# EAGLE design legatus_v0_2 (EAGLE 9.6.2)
CNAME: Parrot Teensy Board; CREVISION: 1.0; DESIGNER: Nathan Villicana-Shaw

## Sheet 1 of 2
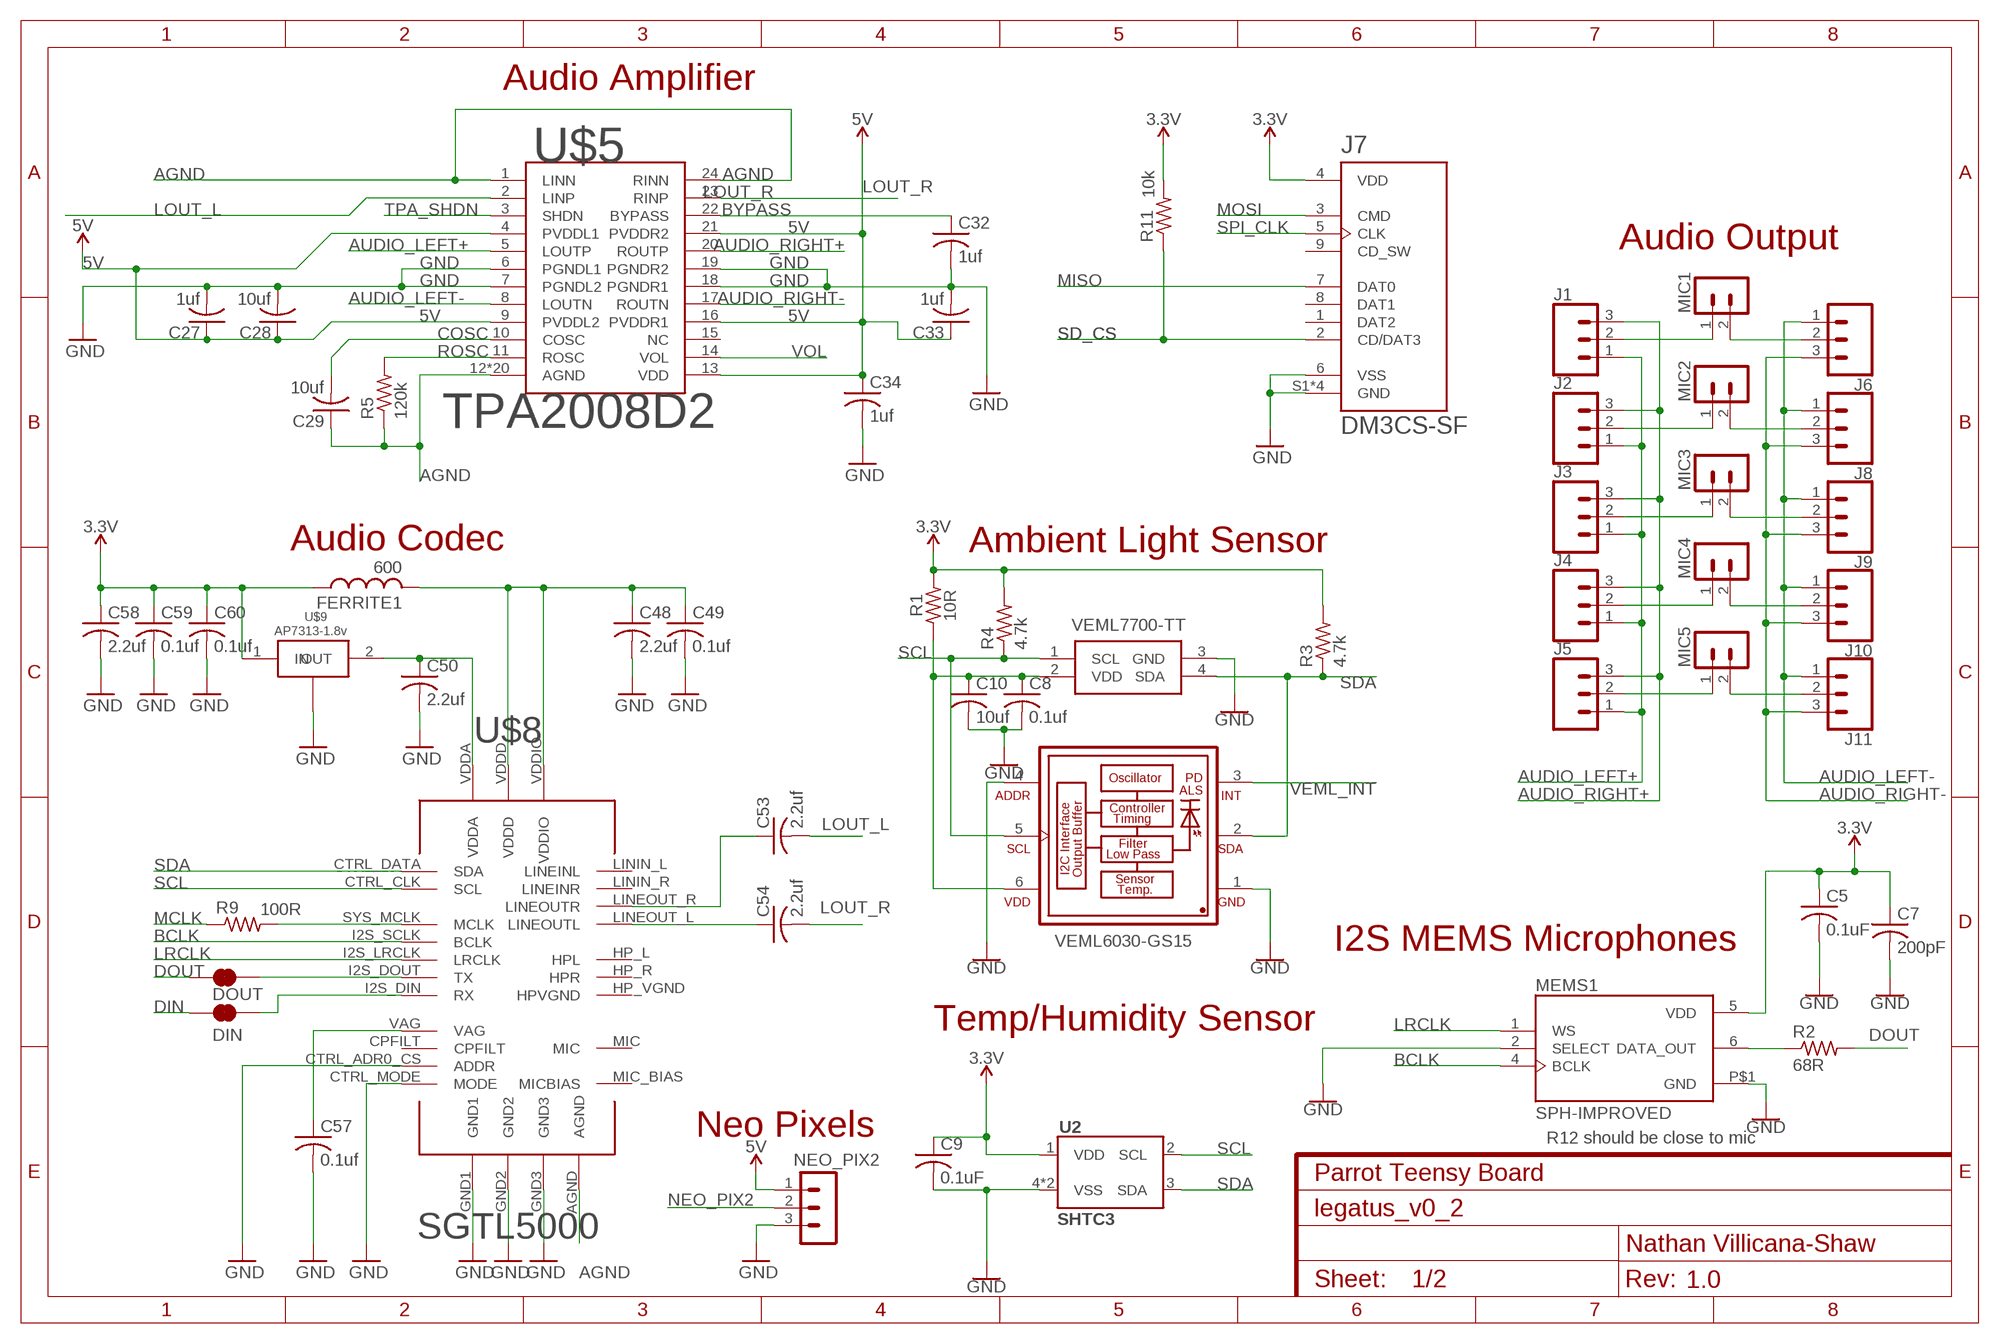
[diagram p0: schematic, sheet 1]

### Parts
C5  0.1uF  C-USC0805  [C0805]
C7  200pF  C-USC0805  [C0805]
C8  0.1uf  C-USC0805  [C0805]
C9  0.1uF  C-USC0805  [C0805]
C10  10uf  C-USC0805  [C0805]
C27  1uf  C-USC0805  [C0805]
C28  10uf  C-USC0805  [C0805]
C29  10uf  C-USC0805  [C0805]
C32  1uf  C-USC0805  [C0805]
C33  1uf  C-USC0805  [C0805]
C34  1uf  C-USC0805  [C0805]
C48  2.2uf  C-USC0805  [C0805]
C49  0.1uf  C-USC0805  [C0805]
C50  2.2uf  C-USC0805  [C0805]
C53  2.2uf  C-USC0805  [C0805]
C54  2.2uf  C-USC0805  [C0805]
C57  0.1uf  C-USC0805  [C0805]
C58  2.2uf  C-USC0805  [C0805]
C59  0.1uf  C-USC0805  [C0805]
C60  0.1uf  C-USC0805  [C0805]
DIN  JUMPER-SMT_2_NC_TRACE_SILK  [SMT-JUMPER_2_NC_TRACE_SILK]
DOUT  JUMPER-SMT_2_NC_TRACE_SILK  [SMT-JUMPER_2_NC_TRACE_SILK]
FERRITE1  600  INDUCTOR_0805_N  [RESC0805_N]
J1  CONN_03  [1X03]
J2  CONN_03  [1X03]
J3  CONN_03  [1X03]
J4  CONN_03  [1X03]
J5  CONN_03  [1X03]
J6  CONN_03  [1X03]
J7  DM3CS-SF  [HRS_DM3CS-SF]
J8  CONN_03  [1X03]
J9  CONN_03  [1X03]
J10  CONN_03  [1X03]
J11  CONN_03  [1X03]
MEMS1  SPH-IMPROVED  [MIC_SPH0645LM4H-B_LARGER_RING]
MIC1  B2B-PH-K  [B2B-PH-K]
MIC2  B2B-PH-K  [B2B-PH-K]
MIC3  B2B-PH-K  [B2B-PH-K]
MIC4  B2B-PH-K  [B2B-PH-K]
MIC5  B2B-PH-K  [B2B-PH-K]
NEO_PIX2  B3B-PH-K  [B3B-PH-K]
R1  10R  R-US_R0805  [R0805]
R2  68R  R-US_M0805  [M0805]
R3  4.7k  R-US_M0805  [M0805]
R4  4.7k  R-US_M0805  [M0805]
R5  120k  R-US_M0805  [M0805]
R9  100R  R-US_M0805  [M0805]
R11  10k  R-US_M0805  [M0805]
U2  SHTC3  [SHTC3]
U$5  TPA2008D2  [PWP-TSSOP24]
U$8  SGTL5000  [QFN-32-5X5MM]
U$9  AP7313-1.8v  AP7313  [SOT-23]
VEML1  VEML7700-TT  [VEML7700]
VMEL1  VEML6030-GS15  [VISHAY_VEML6030_2X2X0.87]

### Nets
3.3V [3.3V]: C5.1 C7.1 C9.1 C58.1 C59.1 C60.1 FERRITE1.1 J7.4(VDD) MEMS1.5(VDD) R1.2 R3.2 R4.2 R11.2 U2.1(VDD) U$9.1(IN) ; also sheet 2
5V: C27.1 C28.1 C33.1 C34.1 NEO_PIX2.1 U$5.4(PVDDL1) U$5.9(PVDDL2) U$5.13(VDD) U$5.16(PVDDR1) U$5.21(PVDDR2) ; also sheet 2
AGND: C29.1 R5.1 U$5.1(LINN) U$5.12(AGND) U$5.24(RINN) U$5.EXP(AGND) U$5.EXP@1(AGND) U$5.EXP@2(AGND) U$5.EXP@3(AGND) U$5.EXP@4(AGND) U$5.EXP@5(AGND) U$5.EXP@6(AGND) U$5.EXP@7(AGND) U$5.EXP@8(AGND) U$5.EXP@9(AGND) U$5.EXP@10(AGND) U$5.EXP@11(AGND) U$5.EXP@12(AGND) U$5.EXP@13(AGND) U$5.EXP@14(AGND) U$5.EXP@15(AGND) U$5.EXP@16(AGND) U$5.EXP@17(AGND) U$5.EXP@18(AGND) U$8.AGND ; also sheet 2
AUDIO_LEFT+: J1.1 J2.1 J3.1 J4.1 J5.1 U$5.5(LOUTP)
AUDIO_LEFT-: J6.1 J8.1 J9.1 J10.1 J11.1 U$5.8(LOUTN)
AUDIO_RIGHT+: J1.3 J2.3 J3.3 J4.3 J5.3 U$5.20(ROUTP)
AUDIO_RIGHT-: J6.3 J8.3 J9.3 J10.3 J11.3 U$5.17(ROUTN)
BCLK: MEMS1.4(BCLK) U$8.I2S_SCLK(BCLK) ; also sheet 2
BYPASS: C32.1 U$5.22(BYPASS)
COSC: C29.2 U$5.10(COSC)
DIN: DIN.1 ; also sheet 2
DOUT: DOUT.1 R2.2 ; also sheet 2
EDITROUTE: C48.1 C49.1 FERRITE1.2 U$8.VDDD U$8.VDDIO
GND: C5.2 C7.2 C8.2 C9.2 C10.2 C27.2 C28.2 C32.2 C33.2 C34.2 C48.2 C49.2 C50.2 C57.2 C58.2 C59.2 C60.2 J7.6(VSS) J7.S1(GND) J7.S2(GND) J7.S3(GND) J7.S5(GND) MEMS1.2(SELECT) MEMS1.P$1(GND) NEO_PIX2.3 U2.4(VSS) U2.5(VSS) U$5.6(PGNDL1) U$5.7(PGNDL2) U$5.18(PGNDR1) U$5.19(PGNDR2) U$8.CTRL_ADR0_CS(ADDR) U$8.CTRL_MODE(MODE) U$8.GND1 U$8.GND2 U$8.GND3 U$9.3(GND) VEML1.3(GND) VMEL1.1(GND) VMEL1.4(ADDR) ; also sheet 2
LOUT_L: C53.2 U$5.2(LINP)
LOUT_R: C54.2 U$5.23(RINP)
LRCLK: MEMS1.1(WS) U$8.I2S_LRCLK(LRCLK) ; also sheet 2
MCLK: R9.1 ; also sheet 2
MISO: J7.7(DAT0) ; also sheet 2
MOSI: J7.3(CMD) ; also sheet 2
N$1: MEMS1.6(DATA_OUT) R2.1
N$2: J1.2 MIC1.1
N$3: J2.2 MIC2.1
N$4: C8.1 C10.1 R1.1 VEML1.2(VDD) VMEL1.6(VDD)
N$6: J3.2 MIC3.1
N$7: J4.2 MIC4.1
N$8: J5.2 MIC5.1
N$25: J6.2 MIC1.2
N$27: C53.1 U$8.LINEOUT_R(LINEOUTR)
N$28: C54.1 U$8.LINEOUT_L(LINEOUTL)
N$32: J8.2 MIC2.2
N$34: C57.1 U$8.VAG
N$35: DIN.2 U$8.I2S_DIN(RX)
N$36: DOUT.2 U$8.I2S_DOUT(TX)
N$38: R9.2 U$8.SYS_MCLK(MCLK)
N$39: C50.1 U$8.VDDA U$9.2(OUT)
N$40: J9.2 MIC3.2
N$42: J10.2 MIC4.2
N$44: J11.2 MIC5.2
NEO_PIX2: NEO_PIX2.2 ; also sheet 2
ROSC: R5.2 U$5.11(ROSC)
SCL: R4.1 U2.2(SCL) U$8.CTRL_CLK(SCL) VEML1.1(SCL) VMEL1.5(SCL) ; also sheet 2
SD_CS: J7.2(CD/DAT3) R11.1 ; also sheet 2
SDA: R3.1 U2.3(SDA) U$8.CTRL_DATA(SDA) VEML1.4(SDA) VMEL1.2(SDA) ; also sheet 2
SPI_CLK: J7.5(CLK) ; also sheet 2
TPA_SHDN: U$5.3(SHDN) ; also sheet 2
VEML_INT: VMEL1.3(INT) ; also sheet 2
VOL: U$5.14(VOL) ; also sheet 2
Unconnected: J7.1(DAT2) J7.8(DAT1) J7.9(CD_SW) U$5.15(NC) U$8.CPFILT U$8.HP_L(HPL) U$8.HP_R(HPR) U$8.HP_VGND(HPVGND) U$8.LININ_L(LINEINL) U$8.LININ_R(LINEINR) U$8.MIC U$8.MIC_BIAS(MICBIAS)

### Notes on the sheet
- Audio Amplifier
- Audio Output
- Audio Codec | Ambient Light Sensor
- 10R
- I2S MEMS Microphones
- Temp/Humidity Sensor
- Neo Pixels
- R12 should be close to mic

## Sheet 2 of 2
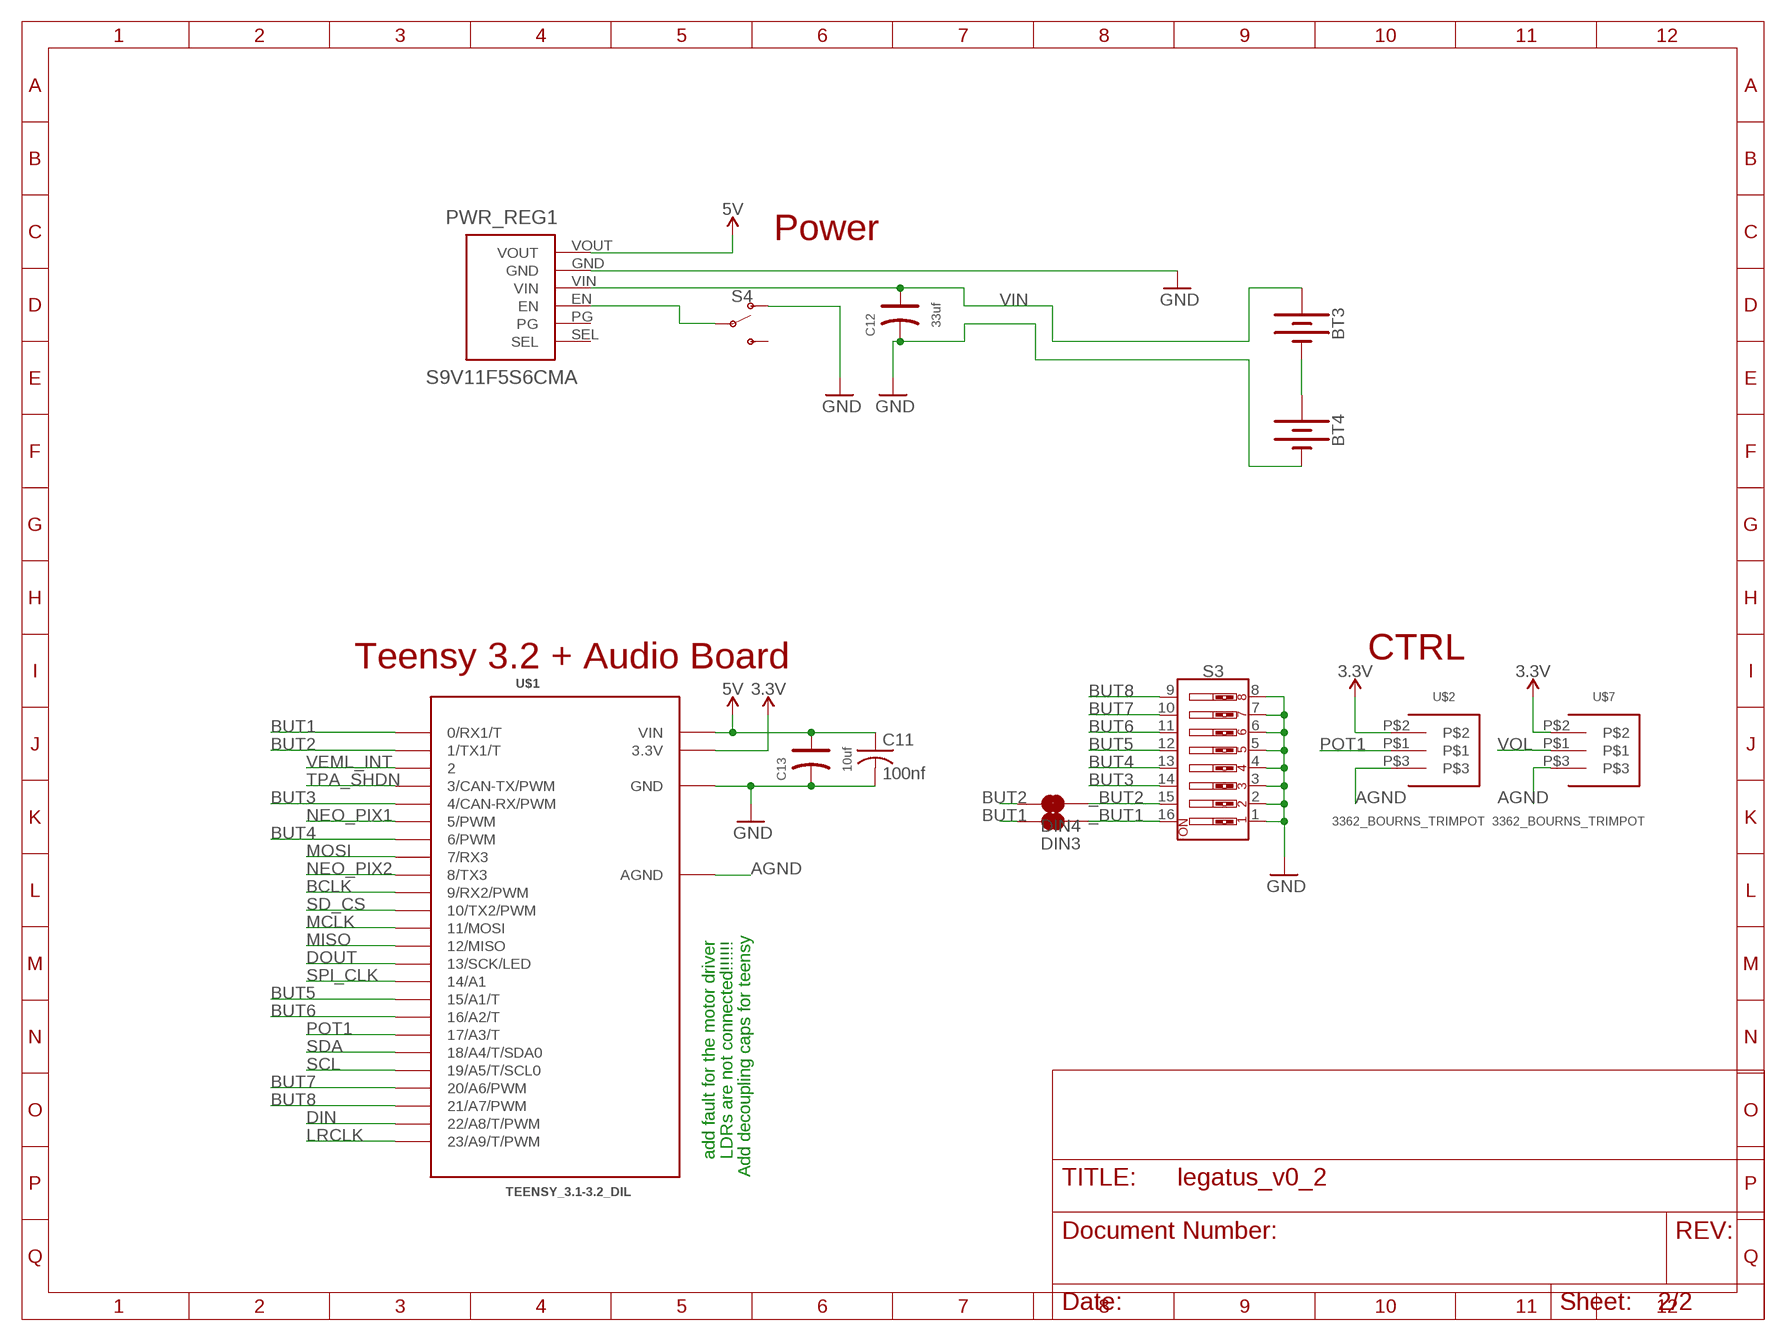
[diagram p1: schematic, sheet 2, part 1 of 2]
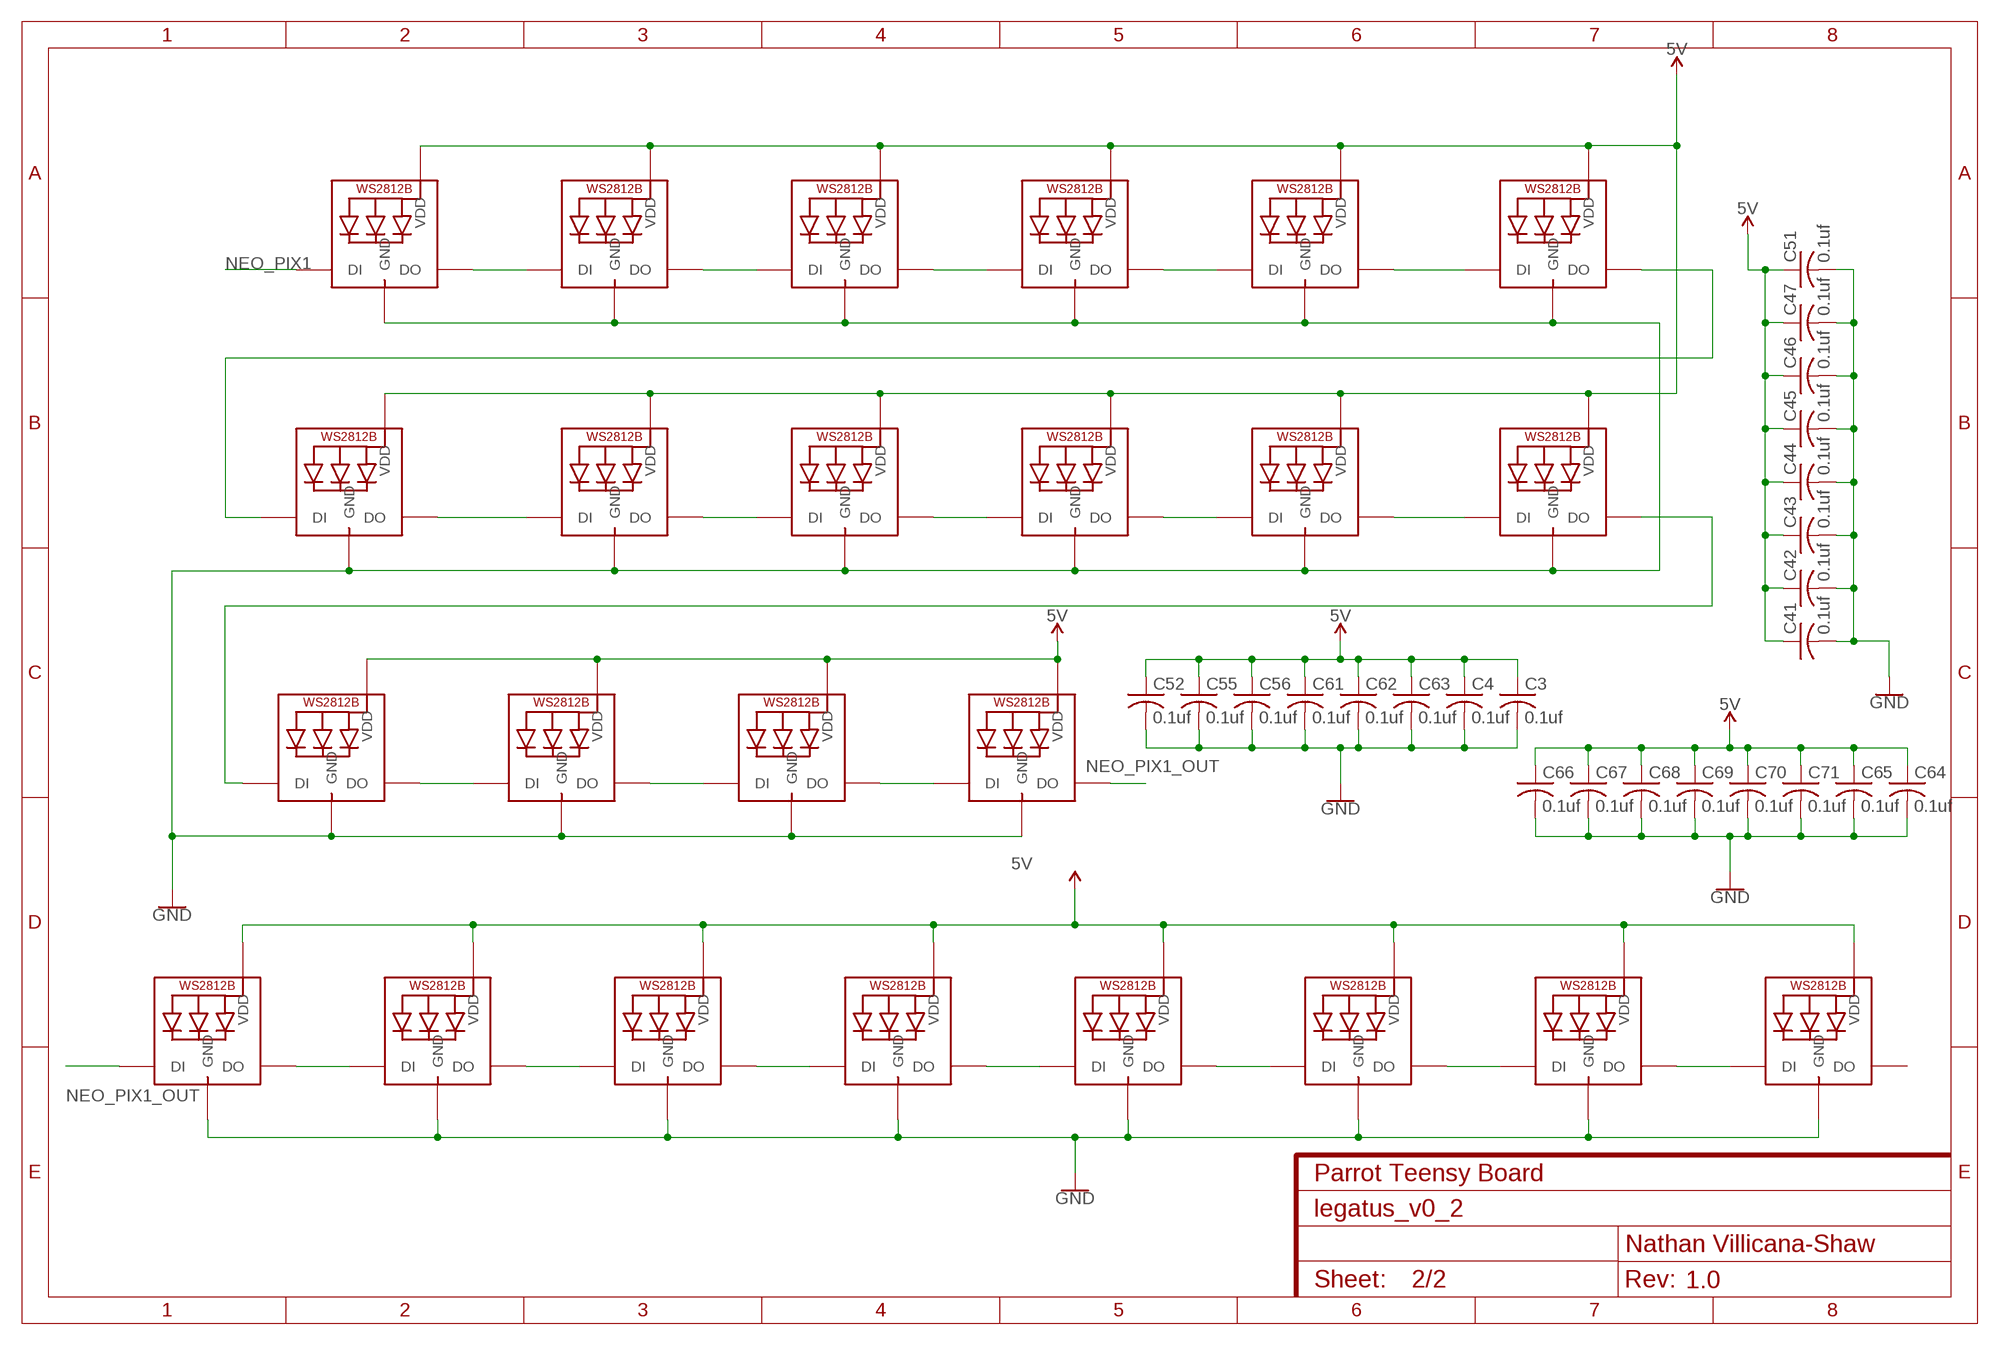
[diagram p2: schematic, sheet 2, part 2 of 2]

### Parts
BT3  BATTERY-18650  [BATTERY_18650-HOLDER]
BT4  BATTERY-18650  [BATTERY_18650-HOLDER]
C3  0.1uf  C-USC0805  [C0805]
C4  0.1uf  C-USC0805  [C0805]
C11  100nf  C-USC2012  [C2012]
C12  33uf  DIP-ALUMINUM-47UF-16V(D5-H7MM)  [PC-D5.3MM]
C13  10uf  DIP-ALUMINUM-47UF-16V(D5-H7MM)  [PC-D5.3MM]
C41  0.1uf  C-USC0805  [C0805]
C42  0.1uf  C-USC0805  [C0805]
C43  0.1uf  C-USC0805  [C0805]
C44  0.1uf  C-USC0805  [C0805]
C45  0.1uf  C-USC0805  [C0805]
C46  0.1uf  C-USC0805  [C0805]
C47  0.1uf  C-USC0805  [C0805]
C51  0.1uf  C-USC0805  [C0805]
C52  0.1uf  C-USC0805  [C0805]
C55  0.1uf  C-USC0805  [C0805]
C56  0.1uf  C-USC0805  [C0805]
C61  0.1uf  C-USC0805  [C0805]
C62  0.1uf  C-USC0805  [C0805]
C63  0.1uf  C-USC0805  [C0805]
C64  0.1uf  C-USC0805  [C0805]
C65  0.1uf  C-USC0805  [C0805]
C66  0.1uf  C-USC0805  [C0805]
C67  0.1uf  C-USC0805  [C0805]
C68  0.1uf  C-USC0805  [C0805]
C69  0.1uf  C-USC0805  [C0805]
C70  0.1uf  C-USC0805  [C0805]
C71  0.1uf  C-USC0805  [C0805]
DIN3  JUMPER-SMT_2_NC_TRACE_SILK  [SMT-JUMPER_2_NC_TRACE_SILK]
DIN4  JUMPER-SMT_2_NC_TRACE_SILK  [SMT-JUMPER_2_NC_TRACE_SILK]
LED25  WS2812B_5050N  [WS2812B-NARROW]
LED26  WS2812B_5050N  [WS2812B-NARROW]
LED27  WS2812B_5050N  [WS2812B-NARROW]
LED28  WS2812B_5050N  [WS2812B-NARROW]
LED29  WS2812B_5050N  [WS2812B-NARROW]
LED30  WS2812B_5050N  [WS2812B-NARROW]
LED31  WS2812B_5050N  [WS2812B-NARROW]
LED32  WS2812B_5050N  [WS2812B-NARROW]
LED33  WS2812B_5050N  [WS2812B-NARROW]
LED34  WS2812B_5050N  [WS2812B-NARROW]
LED35  WS2812B_5050N  [WS2812B-NARROW]
LED36  WS2812B_5050N  [WS2812B-NARROW]
LED37  WS2812B_5050N  [WS2812B-NARROW]
LED38  WS2812B_5050N  [WS2812B-NARROW]
LED39  WS2812B_5050N  [WS2812B-NARROW]
LED40  WS2812B_5050N  [WS2812B-NARROW]
LED41  WS2812B_5050N  [WS2812B-NARROW]
LED42  WS2812B_5050N  [WS2812B-NARROW]
LED43  WS2812B_5050N  [WS2812B-NARROW]
LED44  WS2812B_5050N  [WS2812B-NARROW]
LED45  WS2812B_5050N  [WS2812B-NARROW]
LED46  WS2812B_5050N  [WS2812B-NARROW]
LED47  WS2812B_5050N  [WS2812B-NARROW]
LED48  WS2812B_5050N  [WS2812B-NARROW]
PWR_REG1  S9V11F5S6CMA  [S9V11F3S5CMA]
S3  DIP-08-PTH  [DIPSWITCH-08]
S4  SWITCH-SPDT-PTH-11.6X4.0MM-LOCK  [SWITCH_SPDT_PTH_11.6X4.0MM_LOCK]
U$1  TEENSY_3.1-3.2_DIL  [TEENSY_3.0-3.2&LC_DIL]
U$2  3362_BOURNS_TRIMPOT  [3362_BOURNS_TRIMPOT]
U$7  3362_BOURNS_TRIMPOT  [3362_BOURNS_TRIMPOT]

### Nets
3.3V [3.3V]: U$1.3.3V U$2.P$2 U$7.P$2 ; also sheet 1
5V: C3.1 C4.1 C11.1 C13.+ C41.1 C42.1 C43.1 C44.1 C45.1 C46.1 C47.1 C51.1 C52.1 C55.1 C56.1 C61.1 C62.1 C63.1 C64.1 C65.1 C66.1 C67.1 C68.1 C69.1 C70.1 C71.1 LED25.1-VDD(VDD) LED26.1-VDD(VDD) LED27.1-VDD(VDD) LED28.1-VDD(VDD) LED29.1-VDD(VDD) LED30.1-VDD(VDD) LED31.1-VDD(VDD) LED32.1-VDD(VDD) LED33.1-VDD(VDD) LED34.1-VDD(VDD) LED35.1-VDD(VDD) LED36.1-VDD(VDD) LED37.1-VDD(VDD) LED38.1-VDD(VDD) LED39.1-VDD(VDD) LED40.1-VDD(VDD) LED41.1-VDD(VDD) LED42.1-VDD(VDD) LED43.1-VDD(VDD) LED44.1-VDD(VDD) LED45.1-VDD(VDD) LED46.1-VDD(VDD) LED47.1-VDD(VDD) LED48.1-VDD(VDD) PWR_REG1.VOUT U$1.VIN ; also sheet 1
_BUT1: DIN3.2 S3.16
_BUT2: DIN4.2 S3.15
AGND: U$1.AGND U$2.P$3 U$7.P$3 ; also sheet 1
BCLK: U$1.9(9/RX2/PWM) ; also sheet 1
BUT1: DIN3.1 U$1.0(0/RX1/T)
BUT2: DIN4.1 U$1.1(1/TX1/T)
BUT3: S3.14 U$1.4(4/CAN-RX/PWM)
BUT4: S3.13 U$1.6(6/PWM)
BUT5: S3.12 U$1.15/A1(15/A1/T)
BUT6: S3.11 U$1.16/A2(16/A2/T)
BUT7: S3.10 U$1.20/A6(20/A6/PWM)
BUT8: S3.9 U$1.21/A7(21/A7/PWM)
DIN: U$1.22/A8(22/A8/T/PWM) ; also sheet 1
DOUT: U$1.13(13/SCK/LED) ; also sheet 1
GND: BT4.GND@1(-) C3.2 C4.2 C11.2 C12.- C13.- C41.2 C42.2 C43.2 C44.2 C45.2 C46.2 C47.2 C51.2 C52.2 C55.2 C56.2 C61.2 C62.2 C63.2 C64.2 C65.2 C66.2 C67.2 C68.2 C69.2 C70.2 C71.2 LED25.3-GND(GND) LED26.3-GND(GND) LED27.3-GND(GND) LED28.3-GND(GND) LED29.3-GND(GND) LED30.3-GND(GND) LED31.3-GND(GND) LED32.3-GND(GND) LED33.3-GND(GND) LED34.3-GND(GND) LED35.3-GND(GND) LED36.3-GND(GND) LED37.3-GND(GND) LED38.3-GND(GND) LED39.3-GND(GND) LED40.3-GND(GND) LED41.3-GND(GND) LED42.3-GND(GND) LED43.3-GND(GND) LED44.3-GND(GND) LED45.3-GND(GND) LED46.3-GND(GND) LED47.3-GND(GND) LED48.3-GND(GND) PWR_REG1.GND S3.1 S3.2 S3.3 S3.4 S3.5 S3.6 S3.7 S3.8 S4.1(O) U$1.GND ; also sheet 1
LRCLK: U$1.23/A9(23/A9/T/PWM) ; also sheet 1
MCLK: U$1.11(11/MOSI) ; also sheet 1
MISO: U$1.12(12/MISO) ; also sheet 1
MOSI: U$1.7(7/RX3) ; also sheet 1
N$9: PWR_REG1.EN S4.2(P)
N$10: BT3.GND@1(-) BT4.PWR@1(+)
N$41: LED25.2-DOUT(DO) LED26.4-DIN(DI)
N$45: LED26.2-DOUT(DO) LED27.4-DIN(DI)
N$46: LED27.2-DOUT(DO) LED28.4-DIN(DI)
N$47: LED28.2-DOUT(DO) LED29.4-DIN(DI)
N$48: LED29.2-DOUT(DO) LED30.4-DIN(DI)
N$49: LED31.2-DOUT(DO) LED32.4-DIN(DI)
N$50: LED32.2-DOUT(DO) LED33.4-DIN(DI)
N$51: LED33.2-DOUT(DO) LED34.4-DIN(DI)
N$52: LED34.2-DOUT(DO) LED35.4-DIN(DI)
N$53: LED35.2-DOUT(DO) LED36.4-DIN(DI)
N$54: LED37.2-DOUT(DO) LED38.4-DIN(DI)
N$55: LED38.2-DOUT(DO) LED39.4-DIN(DI)
N$56: LED39.2-DOUT(DO) LED40.4-DIN(DI)
N$57: LED36.2-DOUT(DO) LED37.4-DIN(DI)
N$58: LED30.2-DOUT(DO) LED31.4-DIN(DI)
N$59: LED42.2-DOUT(DO) LED43.4-DIN(DI)
N$60: LED43.2-DOUT(DO) LED44.4-DIN(DI)
N$61: LED44.2-DOUT(DO) LED45.4-DIN(DI)
N$62: LED45.2-DOUT(DO) LED46.4-DIN(DI)
N$63: LED46.2-DOUT(DO) LED47.4-DIN(DI)
N$64: LED47.2-DOUT(DO) LED48.4-DIN(DI)
N$65: LED41.2-DOUT(DO) LED42.4-DIN(DI)
NEO_PIX1: LED25.4-DIN(DI) U$1.5(5/PWM)
NEO_PIX1_OUT: LED40.2-DOUT(DO) LED41.4-DIN(DI)
NEO_PIX2: U$1.8(8/TX3) ; also sheet 1
POT1: U$1.17/A3(17/A3/T) U$2.P$1
SCL: U$1.19/A5(19/A5/T/SCL0) ; also sheet 1
SD_CS: U$1.10(10/TX2/PWM) ; also sheet 1
SDA: U$1.18/A4(18/A4/T/SDA0) ; also sheet 1
SPI_CLK: U$1.14/A0(14/A1) ; also sheet 1
TPA_SHDN: U$1.3(3/CAN-TX/PWM) ; also sheet 1
VEML_INT: U$1.2 ; also sheet 1
VIN [12V_IN]: BT3.PWR@1(+) C12.+ PWR_REG1.VIN
VOL: U$7.P$1 ; also sheet 1
Unconnected: LED48.2-DOUT(DO) PWR_REG1.PG PWR_REG1.SEL S4.3(S)

### Notes on the sheet
- Power
- Teensy 3.2 + Audio Board | CTRL
- add fault for the motor driver | LDRs are not connected!!!!!!
- Add decoupling caps for teensy

## Library data of the parts
BT3 BT4 = SparkFun-Batteries:BATTERY: Battery - Single Cell A variety of battery chemistries, sizes, and footprints. Device List: 20MM_PTH - Coin Cell Battery Holder - 20mm (PTH) <https://www.sparkfun.com/products/783> 6.8MM_PTH - Coin Cell Battery Holder - 6.8MM(SMD) <https://www.digikey.com/product-detail/en/seiko-instruments/MS621FE-FL11E/728-1057-ND/1889208?WT.srch=1&gclid=CNOQ5a6LzdQCFZS2wAodXCkE0g> 12MM_SMD - Coin Cell Battery Holder - 12mm (SMD) <https://www.sparkfun.com/products/10592> 12MM_PTH - Coin Cell Battery Holder - 12mm (PTH) <https://www.sparkfun.com/products/7948> 20MM_SMD - 20mm Coin Cell Battery Holder (SMD) (2 legs) Used on the Big Time Watch Kit <https://www.sparkfun.com/products/11734> 20MM_SMD_4LEGS - Coin Cell Battery Holder - 20mm (SMD) <https://www.sparkfun.com/products/11892> 20MM_SMD_4LEGS_OVERPASTE - Coin Cell Battery Holder - 20mm (SMD) <https://www.sparkfun.com/products/11892> (Over-paste on the legs) 24.5MM_PTH - Coin Cell Battery Holder - 24.5mm (PTH) <https://www.sparkfun.com/products/8863> 9V - 9V Battery Holder - PC Mount Used on the SparkFun SparkPunk Sound Kit <https://www.sparkfun.com/products/11177> and SparkFun SparkPunk Sequencer Kit <https://www.sparkfun.com/products/12707> 18650 - Battery Holder - 18650 (PTH) <https://www.sparkfun.com/products/13113> AA - Battery Holder - 1xAA (PTH) <https://www.sparkfun.com/products/7949> AAA - Battery Holder - 1xAAA (PTH) <https://www.sparkfun.com/products/12718> AA_KIT - Battery Holder - 1xAA (PTH) <https://www.sparkfun.com/products/7949> Special kit package - pads only have exposed copper on one side of the board. AAA_KIT - Battery Holder - 1xAAA (PTH) <https://www.sparkfun.com/products/12718> Special kit package - pads only have exposed copper on one side of the board.; PROD_ID: BATT-12327; SF_SKU: PRT-13113
C3-C5 C7-C10 C27-C29 C32-C34 C41-C71 = rcl:C-US: CAPACITOR, American symbol; SPICEPREFIX: C
C11 = adafruit:C-US: CAPACITOR, American symbol
C12 C13 = Seeed-Capacitor:DIP-ALUMINUM-47UF-16V(D5-H7MM): 302030033; MPN: KS 100uF/16V; VALUE: 100uf
DIN DIN3 DIN4 DOUT = SparkFun-Jumpers:JUMPER-SMT_2_NC_TRACE: Normally closed trace jumper This jumper has a trace between two pads so it's normally closed (NC). Use a razor knife to open the connection. For best results follow the IPC guidelines for cutting traces: Cutout at least 0.063 mm (0.005 in). Remove all loose material to clean up the cut area. Seal the cut with an approved epoxy. Reapply solder to reclose the connection.
FERRITE1 = Nordic_nRF:INDUCTOR: Generic chip inductor
J1-J6 J8-J11 = SparkFun-Connectors:CONN_03: Multi connection point. Often used as Generic Header-pin footprint for 0.1 inch spaced/style header connections On any of the 0.1 inch spaced packages, you can populate with these: Break Away Headers - Straight <https://www.sparkfun.com/products/116> (PRT-00116) Break Away Male Headers - Right Angle <https://www.sparkfun.com/products/553> (PRT-00553) Female Headers <https://www.sparkfun.com/products/115> (PRT-00115) Break Away Headers - Machine Pin <https://www.sparkfun.com/products/117> (PRT-00117) Break Away Female Headers - Swiss Machine Pin <https://www.sparkfun.com/products/743> (PRT-00743) Stackable Header - 3 Pin (Female, 0.1") <https://www.sparkfun.com/products/13875> (PRT-13875) For SCREWTERMINALS and SPRING TERMINALS visit here: Screw Terimnals on SparkFun.com <https://www.sparkfun.com/search/results?term=Screw+Terminals> (5mm/3.5mm/2.54mm spacing) This device is also useful as a general connection point to wire up your design to another part of your project. Our various solder wires solder well into these plated through hole pads. Hook-Up Wire - Assortment (Stranded, 22 AWG) <https://www.sparkfun.com/products/11375> (PRT-11375) Hook-Up Wire - Assortment (Solid Core, 22 AWG) <https://www.sparkfun.com/products/11367> (PRT-11367) View the entire wire category on our website here <https://www.sparkfun.com/categories/141> Special notes: Molex polarized connector foot print use with SKU : PRT-08232 with associated crimp pins and housings.
J7 = DM3CS-SF:DM3CS-SF: CONN MICRO SD CARD HINGED TYPE; AVAILABILITY: Unavailable; DESCRIPTION: 10 (8 + 2) Position Card Connector Secure Digital - microSD™ Surface Mount, Right Angle Gold; MF: Hirose; MP: DM3CS-SF; PACKAGE: None; PRICE: None
LED25-LED48 = nathans-custom-parts:WS2812B
MEMS1 = SPH0645LM4H-B:SPH-IMPROVED
MIC1-MIC5 = con-jst-ph:B2B-PH-K: HEADER
NEO_PIX2 = con-jst-ph:B3B-PH-K: HEADER
PWR_REG1 = nathans-custom-parts:S9V11F5S6CMA
R1 = audio amplifier example:R-US_: RESISTOR, American symbol
R2-R5 = adafruit:R-US_: RESISTOR, American symbol
R9 R11 = rcl:R-US_: RESISTOR, American symbol; SPICEPREFIX: R
S3 = SparkFun-Switches:DIP-08: 8-Position DIP Switch 8-circuit DIP (dual inline package) switch. Commonly used to physcially set a circuit's behavior. SparkFun Products DIP Switch - 8 Position <https://www.sparkfun.com/products/8034> (COM-08034); PROD_ID: SWCH-12197; SF_SKU: COM-08034
S4 = SparkFun-Switches:SWITCH-SPDT: Single Pole, Double Throw (SPDT) Switch Single-pole, double-throw (SPDT) switch. Variant Overview SMD-AYZ0202 Surface Mount DPDT Switch <https://www.sparkfun.com/products/597> (COM-00597) Used on e.g. LilyPad Arduino USB - ATmega32U4 Board <https://www.sparkfun.com/products/12049> PTH-11.6X4.0MM SPDT Mini Power Switch <https://www.sparkfun.com/products/102> (COM-00102) Used on e.g. SparkFun Simon Says - Through-Hole Soldering Kit <https://www.sparkfun.com/products/10547> (KIT-10547) PTH-11.6X4.0MM-KIT KIT version of SPDT Mini Power Switch - Simplifies soldering by removing tStop of switch pins - only one side can be soldered. PTH-11.6X4.0MM-LOCK LOCK version of SPDT Mini Power Switch - Offset pins hold switch in place for easier soldering. SMD-RIGHT-ANGLE Surface Mount Right Angle Switch <https://www.sparkfun.com/products/10860> (COM-10860) Used on e.g. SparkFun ESP8266 Thing <https://www.sparkfun.com/products/13231>; PROD_ID: SWCH-08261; SF_SKU: COM-00102
U2 = SHTC3:SHTC3
U$1 = teensy_3_and_LC:TEENSY_3.1-3.2_DIL: Teensy 3.1 or 3.2 in a DIL Layout.
U$2 U$7 = nathans-custom-parts:3362_BOURNS_TRIMPOT
U$5 = TPA2008D3:TPA2008D2
U$8 = sgtl5000:SGTL5000
U$9 = AP7313:AP7313
VEML1 = VEML7700-TT:VEML7700-TT: 16Bit Ambient Light Sensor I2C 6.8x2.3mm Source: Datasheet <https://www.arrow.com/en/products/veml7700-tt/vishay>; DESCRIPTION: 16Bit Ambient Light Sensor I2C 6.8x2.3mm; HEIGHT: mm; MANUFACTURER_NAME: Vishay; MANUFACTURER_PART_NUMBER: VEML7700-TT; MOUSER_PART_NUMBER: 78-VEML7700-TT; MOUSER_PRICE-STOCK: https://www.mouser.com/Search/Refine.aspx?Keyword=78-VEML7700-TT; RS_PART_NUMBER: 1226791P; RS_PRICE-STOCK: http://uk.rs-online.com/web/p/products/1226791P
VMEL1 = VEML6030-GS15:VEML6030-GS15: VEML6030 High Accuracy Ambient Light Sensor with I2C Interface: VEML6030 is a high accuracy ambient light digital 16-bit resolution sensor in a miniature transparent 2 mm x 2 mm package. It includes a high sensitive photodiode, a low noise amplifier, a 16-bit A/D converter and supports an easy to use I2C bus communication interface and additional interrupt feature. The ambient light result is as digital value available. Device Model created 15.06.2016 by Johannes Kolb - Vishay Semiconductor GmbH; AVAILABILITY: Unavailable; DESCRIPTION: Optical Sensor Ambient 550nm I²C 6-SMD, No Lead; MF: Vishay Semiconductor; MP: VEML6030-GS15; PACKAGE: SMD-6 Vishay; PRICE: None

## Net classes
0 default: width 0.203 mm, drill 0.254 mm, clearance 0.203 mm
1 12V_IN: width 1.016 mm, drill 0.762 mm, clearance 0.305 mm
2 3.3V: width 0.305 mm, drill 0.508 mm, clearance 0.254 mm
3 5V: width 0.787 mm, drill 0.508 mm, clearance 0.381 mm

## Board
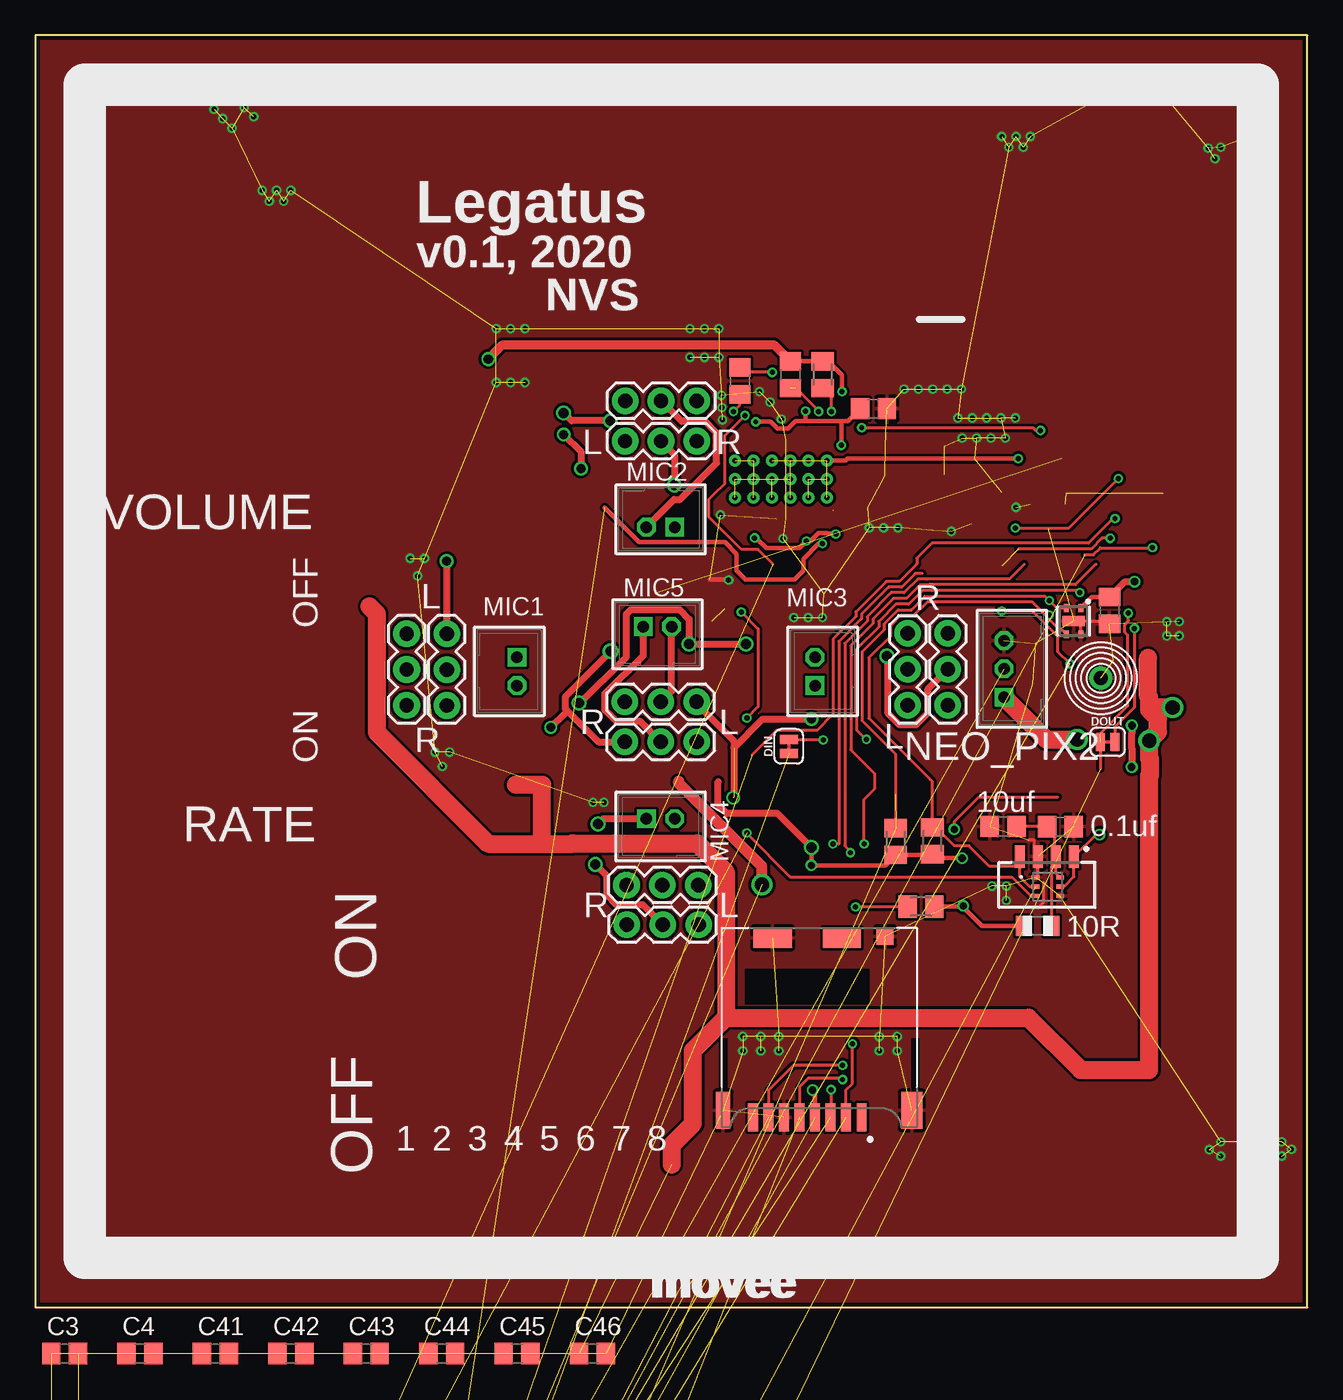
[diagram p3: board, top side]
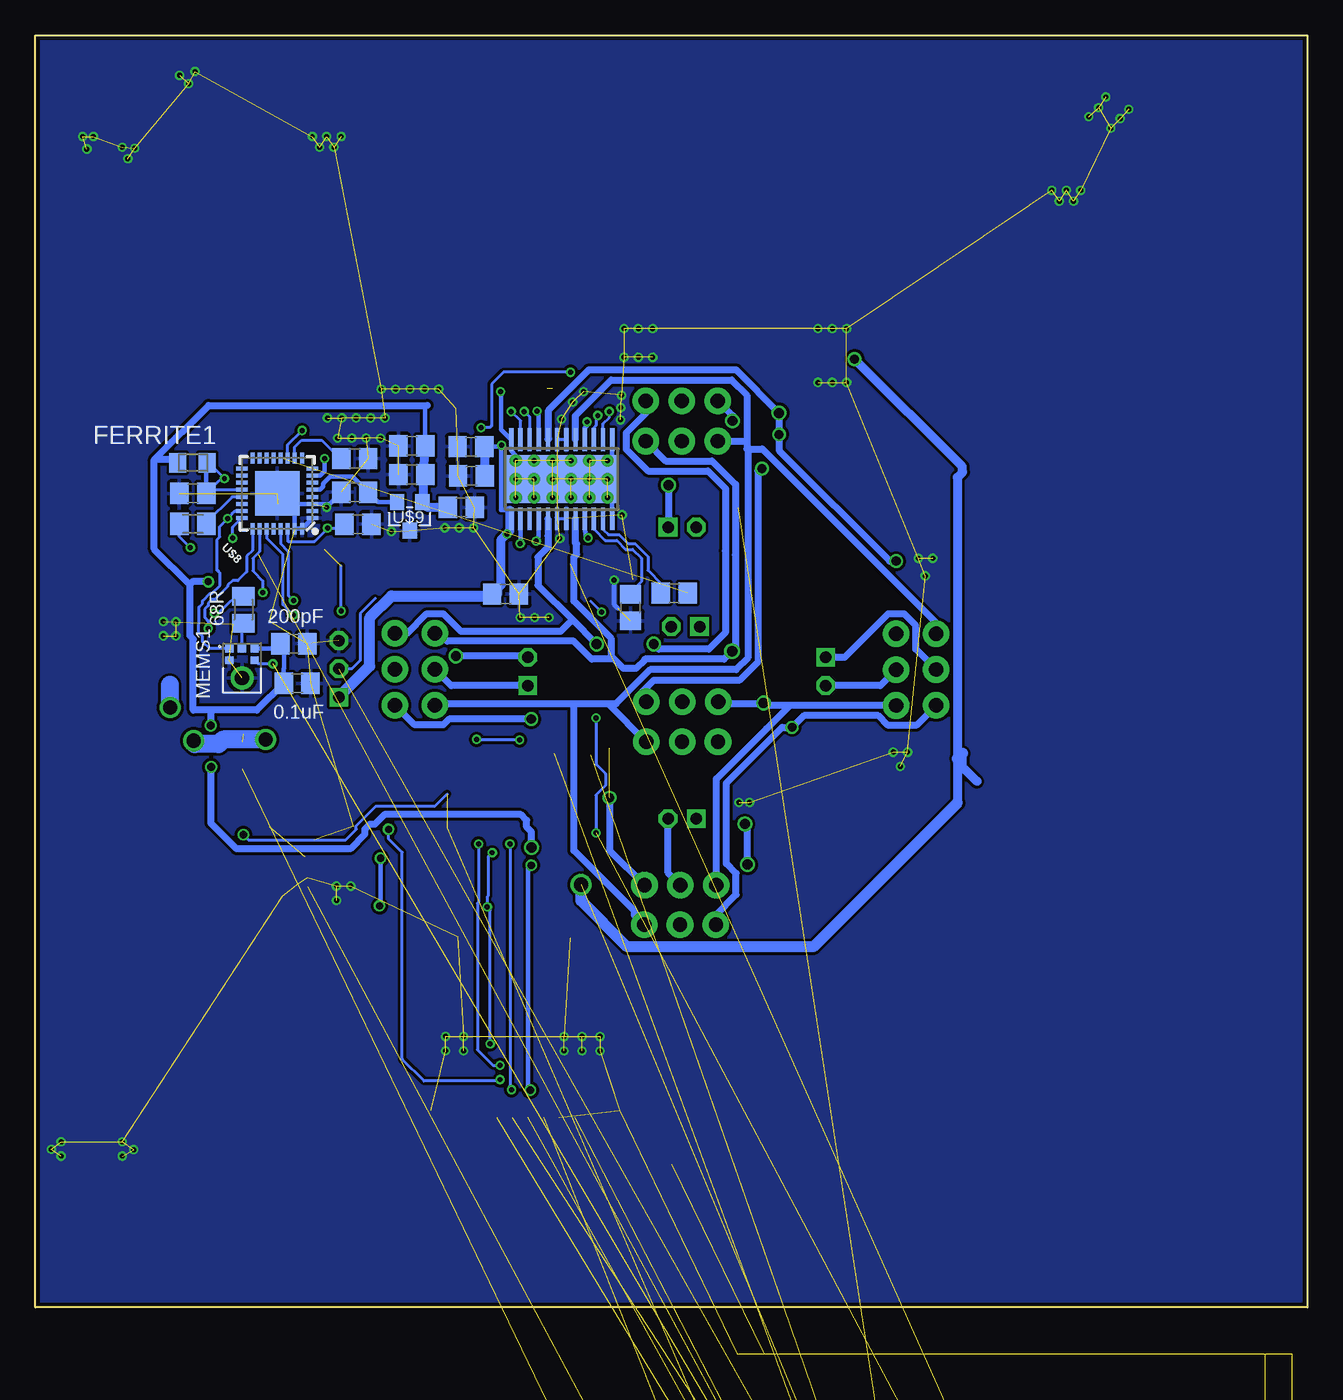
[diagram p4: board, bottom side, seen from below]

Size 90 x 90 mm. Coordinates in mm from the lower left corner, seen from the top.
Outline: 0,90 0,0 90,0 90,90 0,90
Copper layers (1*16): Top 0.035mm / dielectric 1.5mm / Bottom 0.035mm
Design rules "SeeedStudio_2layer_DRU_no_angle_20140221": minimum track width 6mil, minimum drill 12mil, track to track 6mil, track to pad 6mil, pad to pad 6mil, via to via 6mil, smd to smd 0mil, copper to edge 10mil, drill to drill 10mil, minimum pad ring 10mil, minimum via ring 6mil, stop-mask expansion 2mil, vias tented up to drill 100mil, thermal gap 10mil

### Footprints (pad centres in the part's own frame; a part is rotated, then mirrored left to right if it is on the bottom)
BATTERY_18650-HOLDER = drill 1.829: GND@1 30.628,0.01; GND@2 23.88,2.55; GND@3 23.88,-2.53; PWR@1 -30.628,-0.01; PWR@2 -23.88,2.53; PWR@3 -23.88,-2.55
C0805 = smd 1.3 x 1.5: 1 -0.95,0; 2 0.95,0
C2012 = smd 1.3 x 1.5: 1 -0.85,0; 2 0.85,0
PC-D5.3MM = drill 0.8 pad 1.35 square: + -1,0 | drill 0.8 pad 1.35: - 1,0
SMT-JUMPER_2_NC_TRACE_SILK = smd 0.635 x 1.27: 1 -0.508,0; 2 0.508,0
RESC0805_N = smd 1.2 x 1.35: 1 -1.1,0; 2 1,0
1X03 = drill 1.016 pad 1.88: 1 0,0; 2 2.54,0; 3 5.08,0
HRS_DM3CS-SF = smd 0.7 x 2: 1 3.2,-6.35; 2 2.1,-6.35; 3 1,-6.35; 4 -0.1,-6.35; 5 -1.2,-6.35; 6 -2.3,-6.35; 7 -3.4,-6.35; 8 -4.5,-6.35 | smd 2.7 x 1.4: 9 1.8,6.35; S3 -3.1,6.35 | smd 1 x 2.6: S1 -6.6,-5.85 | smd 1.5 x 2.6: S2 6.75,-5.85 | smd 1.2 x 1.2: S5 4.85,6.45
WS2812B-NARROW = smd 1.3 x 1.2: 1-VDD 2.35,-1.65; 2-DOUT 2.35,1.65; 3-GND -2.35,1.65; 4-DIN -2.35,-1.65
MIC_SPH0645LM4H-B_LARGER_RING = smd 0.6 x 0.522: 1 -0.9,2.074; 2 -0.9,1.252; 4 0.9,1.252; 5 0.9,2.074; 6 0,2.074 | drill 1 pad 1.626: P$1 0,0
B2B-PH-K = drill 0.813 square: 1 -1,0 | drill 0.813 octagon: 2 1,0
B3B-PH-K = drill 0.813 square: 1 -2,0 | drill 0.813 octagon: 2 0,0; 3 2,0
S9V11F3S5CMA = drill 0.85: EN 3.81,1.27; PG 1.27,1.27; SEL 1.27,3.81; VIN 6.35,1.27; VOUT 11.43,1.27 | drill 0.85 square: GND 8.89,1.27
R0805 = smd 1.1 x 1.4: 1 -1,0; 2 1,0
M0805 = smd 1.3 x 1.6: 1 -0.95,0; 2 0.95,0
DIPSWITCH-08 = drill 0.97 long: 1 -8.89,-3.81; 2 -6.35,-3.81; 3 -3.81,-3.81; 4 -1.27,-3.81; 5 1.27,-3.81; 6 3.81,-3.81; 7 6.35,-3.81; 8 8.89,-3.81; 9 8.89,3.81; 10 6.35,3.81; 11 3.81,3.81; 12 1.27,3.81; 13 -1.27,3.81; 14 -3.81,3.81; 15 -6.35,3.81; 16 -8.89,3.81
SWITCH_SPDT_PTH_11.6X4.0MM_LOCK = drill 1.016 pad 1.88: 1 0,2.718; 2 0,0; 3 0,-2.718
SHTC3 = smd 0.55 x 0.35: 1 -0.925,0.5; 2 -0.925,-0.5; 3 0.925,-0.5; 4 0.925,0.5 | smd 0.7 x 1.6: 5 0,0
TEENSY_3.0-3.2&LC_DIL = drill 0.965: 0 -7.62,13.97; 1 -7.62,11.43; 2 -7.62,8.89; 3 -7.62,6.35; 3.3V 7.62,11.43; 4 -7.62,3.81; 5 -7.62,1.27; 6 -7.62,-1.27; 7 -7.62,-3.81; 8 -7.62,-6.35; 9 -7.62,-8.89; 10 -7.62,-11.43; 11 -7.62,-13.97; 12 -7.62,-16.51; 13 7.62,-16.51; 14/A0 7.62,-13.97; 15/A1 7.62,-11.43; 16/A2 7.62,-8.89; 17/A3 7.62,-6.35; 18/A4 7.62,-3.81; 19/A5 7.62,-1.27; 20/A6 7.62,1.27; 21/A7 7.62,3.81; 22/A8 7.62,6.35; 23/A9 7.62,8.89; AGND 7.62,13.97; GND -7.62,16.51; VIN 7.62,16.51
3362_BOURNS_TRIMPOT = drill 1: P$1 0,2.54; P$2 -2.54,0; P$3 2.54,0
PWP-TSSOP24 = smd 1.6 x 0.3: 1 -2.8,3.575; 2 -2.8,2.925; 3 -2.8,2.275; 4 -2.8,1.625; 5 -2.8,0.975; 6 -2.8,0.325; 7 -2.8,-0.325; 8 -2.8,-0.975; 9 -2.8,-1.625; 10 -2.8,-2.275; 11 -2.8,-2.925; 12 -2.8,-3.575; 13 2.8,-3.575; 14 2.8,-2.925; 15 2.8,-2.275; 16 2.8,-1.625; 17 2.8,-0.975; 18 2.8,-0.325; 19 2.8,0.325; 20 2.8,0.975; 21 2.8,1.625; 22 2.8,2.275; 23 2.8,2.925; 24 2.8,3.575 | smd 3.4 x 7.8: EXP 0,0 | drill 0.35 pad 0.7: EXP@1 -1.3,3.25; EXP@2 0,3.25; EXP@3 1.3,3.25; EXP@4 -1.3,1.95; EXP@5 0,1.95; EXP@6 1.3,1.95; EXP@7 -1.3,0.65; EXP@8 0,0.65; EXP@9 1.3,0.65; EXP@10 -1.3,-0.65; EXP@11 0,-0.65; EXP@12 1.3,-0.65; EXP@13 -1.3,-1.95; EXP@14 0,-1.95; EXP@15 1.3,-1.95; EXP@16 -1.3,-3.25; EXP@17 0,-3.25; EXP@18 1.3,-3.25
QFN-32-5X5MM = smd 0.285 x 0.8: 8 1.75,-2.5; 17 1.75,2.5; 19 0.75,2.5; 22 -0.75,2.5; AGND 1.25,-2.5; CPFILT 1.25,2.5; GND2 -1.75,-2.5; GND3 -0.75,-2.5; HP_L 0.75,-2.5; HP_R -1.25,-2.5; HP_VGND -0.25,-2.5; I2S_LRCLK -1.25,2.5; I2S_SCLK -1.75,2.5; SYS_MCLK -0.25,2.5; VDDA 0.25,-2.5; VDDIO 0.25,2.5 | smd 0.8 x 0.285: 9 2.5,-1.75; 28 -2.5,0.25; CTRL_ADR0_CS -2.5,-1.25; CTRL_CLK -2.5,-0.25; CTRL_DATA -2.5,0.75; CTRL_MODE -2.5,-1.75; I2S_DIN -2.5,1.25; I2S_DOUT -2.5,1.75; LINEOUT_L 2.5,-0.25; LINEOUT_R 2.5,-0.75; LININ_L 2.5,0.75; LININ_R 2.5,0.25; MIC 2.5,1.25; MIC_BIAS 2.5,1.75; VAG 2.5,-1.25; VDDD -2.5,-0.75 | smd 3.15 x 3.15: GND1 0,0
SOT-23 = smd 1.016 x 1.143: 1 -0.889,-1.016; 2 0.889,-1.016; 3 0,1.016
VEML7700 = smd 0.7 x 1.6: 1 1.495,-0.4; 2 2.765,-0.4; 3 4.035,-0.4; 4 5.305,-0.4
VISHAY_VEML6030_2X2X0.87 = smd 0.55 x 0.3: 1 -0.875,0.65; 2 -0.875,0; 3 -0.875,-0.65; 4 0.875,-0.65; 5 0.875,0; 6 0.875,0.65

### Placement (x,y rotation side)
BT3  35.35,-94.7 0 top  (outside the outline)
BT4  35.35,-112.99 0 top  (outside the outline)
C3  2.07,-3.26 0 top  (outside the outline)
C4  7.41,-3.26 0 top  (outside the outline)
C5  71.48,44.16 0 bottom
C7  71.7,46.96 0 bottom
C8  72.52,34.02 0 top
C9  76,49.31 270 top
C10  68.47,34.03 180 top
C11  15.79,-141.44 0 top  (outside the outline)
C12  51.35,-126.45 0 top  (outside the outline)
C13  58.72,-126.45 0 top  (outside the outline)
C27  59.3,63.59 0 top
C28  59.18,60.9 180 bottom
C29  53.42,66 270 top
C32  47.89,49.52 270 bottom
C33  59.15,58.84 180 bottom
C34  56.74,50.48 0 bottom
C41  12.74,-3.26 0 top  (outside the outline)
C42  18.08,-3.26 0 top  (outside the outline)
C43  23.41,-3.26 0 top  (outside the outline)
C44  28.74,-3.26 0 top  (outside the outline)
C45  34.08,-3.26 0 top  (outside the outline)
C46  39.41,-3.26 0 top  (outside the outline)
C47  2.07,-9.61 0 top  (outside the outline)
C48  78.86,57.6 180 bottom
C49  67.17,55.41 0 bottom
C50  67.4,57.67 180 bottom
C51  7.41,-9.61 0 top  (outside the outline)
C52  12.74,-9.61 0 top  (outside the outline)
C53  49.85,65.55 270 top
C54  44.8,50.54 180 bottom
C55  18.08,-9.61 0 top  (outside the outline)
C56  23.41,-9.61 0 top  (outside the outline)
C57  67.4,60.06 0 bottom
C58  59.86,56.61 0 bottom
C59  63.36,58.92 180 bottom
C60  63.36,60.95 180 bottom
C61  28.74,-9.61 0 top  (outside the outline)
C62  34.08,-9.61 0 top  (outside the outline)
C63  39.41,-9.61 0 top  (outside the outline)
C64  2.07,-15.96 0 top  (outside the outline)
C65  7.41,-15.96 0 top  (outside the outline)
C66  12.74,-15.96 0 top  (outside the outline)
C67  18.08,-15.96 0 top  (outside the outline)
C68  23.41,-15.96 0 top  (outside the outline)
C69  28.74,-15.96 0 top  (outside the outline)
C70  34.08,-15.96 0 top  (outside the outline)
C71  39.41,-15.96 0 top  (outside the outline)
DIN  53.31,39.69 90 top
DIN3  26.71,-140.67 0 top  (outside the outline)
DIN4  40.43,-140.67 0 top  (outside the outline)
DOUT  75.86,40.02 0 top
FERRITE1  78.83,59.76 0 bottom
J1  26.27,47.67 270 top
J2  41.72,61.29 0 top
J3  61.73,42.61 90 top
J4  46.93,27.08 180 top
J5  46.79,40.02 180 top
J6  29.1,47.67 270 top
J7  55.26,19.8 0 top
J8  41.72,64.15 0 top
J9  64.56,42.61 90 top
J10  46.91,29.89 180 top
J11  46.78,42.84 180 top
LED25  3.09,-22.56 0 top  (outside the outline)
LED26  10.96,-22.56 0 top  (outside the outline)
LED27  18.84,-22.56 0 top  (outside the outline)
LED28  26.71,-22.56 0 top  (outside the outline)
LED29  34.59,-22.56 0 top  (outside the outline)
LED30  3.09,-28.66 0 top  (outside the outline)
LED31  10.96,-28.66 0 top  (outside the outline)
LED32  18.84,-28.66 0 top  (outside the outline)
LED33  26.71,-28.66 0 top  (outside the outline)
LED34  34.59,-28.66 0 top  (outside the outline)
LED35  3.09,-34.76 0 top  (outside the outline)
LED36  10.96,-34.76 0 top  (outside the outline)
LED37  18.84,-34.76 0 top  (outside the outline)
LED38  26.71,-34.76 0 top  (outside the outline)
LED39  34.59,-34.76 0 top  (outside the outline)
LED40  3.09,-40.85 0 top  (outside the outline)
LED41  10.96,-40.85 0 top  (outside the outline)
LED42  18.84,-40.85 0 top  (outside the outline)
LED43  26.71,-40.85 0 top  (outside the outline)
LED44  34.59,-40.85 0 top  (outside the outline)
LED45  3.09,-46.95 0 top  (outside the outline)
LED46  10.96,-46.95 0 top  (outside the outline)
LED47  18.84,-46.95 0 top  (outside the outline)
LED48  26.71,-46.95 0 top  (outside the outline)
MEMS1  75.38,44.53 0 bottom
MIC1  34.08,45 270 top
MIC2  44.24,55.21 180 top
MIC3  55.16,45 90 top
MIC4  44.24,34.59 0 top
MIC5  44.01,48.17 0 top
NEO_PIX2  68.53,45.18 90 top
PWR_REG1  2.58,-137.37 0 top  (outside the outline)
R1  70.91,27 180 top
R2  75.27,49.37 90 bottom
R3  63.47,33.01 270 top
R4  60.88,32.96 270 top
R5  55.71,66 270 top
R9  78.86,55.44 0 bottom
R11  62.65,28.36 0 top
S3  35.6,-127.47 0 top  (outside the outline)
S4  21.12,-127.97 0 top  (outside the outline)
U2  73.46,48.56 270 top
U$1  8.93,-67.52 0 top  (outside the outline)
U$2  3.34,-142.45 0 top  (outside the outline)
U$5  52.76,58.6 270 bottom
U$7  10.2,-142.45 0 top  (outside the outline)
U$8  72.89,57.6 90 bottom
U$9  63.52,55.97 180 bottom
VEML1  74.97,31.5 180 top
VMEL1  71.62,29.77 0 top

### Tracks (layer width: path | path; a pad name or v marks a point on that pad's centre or on a via)
3.3V  (via drill 0.51, 0.55, 0.7)  (3 unrouted)
  Top 0.305: R11.2 65.6,28.36 | 65.6,28.36 v65.65,28.41 | v65.57,31.79 63.74,31.79 R3.2 63.42,32.01 R4.2 60.15,31.28 v54.91,31.28 v54.91,32.55 | U2.1 74.74,50.26 C9.1 | R1.2 66.97,27 65.6,28.36 | J7.4 55.16,15.21 v54.98,15.38
  Top 0.508: 48.31,37.2 48.31,35.58 48.95,34.94 52.52,34.94 v54.91,32.55 | C9.1 77.09,51.35 v77.77,51.35 | v77.56,38.24 77.59,38.27 77.59,39.53 77.54,39.58 77.54,40.62 77.59,40.67 v77.59,41.16
  Bottom 0.305: v65.65,28.41 65.57,28.49 v65.57,31.79 | MEMS1.5 73.01,46.6 C7.1 72.41,46.72 72.41,45.22 72.43,45.2 C5.1 | C60.1 62.41,63.68 62.27,63.82 | v54.98,15.38 55.13,15.54 55.13,31.05 v54.91,31.28
  Bottom 0.508: 79.09,51.15 79.06,51.12 79.06,47.51 78.83,47.28 78.83,42.26 77.59,42.26 | 79.09,51.15 81.58,53.64 81.58,59.99 | 81.58,59.99 80.16,59.99 FERRITE1.1 | 79.09,51.15 78.88,51.35 v77.77,51.35 | 81.58,59.99 77.74,63.82 62.27,63.82 | v77.56,38.24 77.56,34.26 75.76,32.45 67.71,32.45 66.69,33.47 66.69,33.82 66.34,34.18 65.98,34.18 65.3,34.87 55.64,34.87 55.23,34.46 55.23,33.99 54.91,33.66 v54.91,32.55 | 77.59,42.26 v77.59,41.16 | 77.59,42.26 74.33,42.26 C5.1
  Bottom 0.635: C59.1 62.53,58.76 | 62.53,58.76 C60.1 | C58.1 62.25,56.61 U$9.1 62.53,57.09 62.53,58.76
5V  (via drill 0.35, 1)  (53 unrouted)
  Top 0.305: C27.1 58.36,63.57 57.5,62.71 57.04,62.71 | v54.5,63.41 54.5,63.37 | v56.63,54.72 v56.63,54.73 56.63,54.75 56.02,54.75 56,54.78 55.39,54.78 54.84,54.23 v54.56,54.23 54.05,53.71 51.73,53.71 50.99,54.45 v50.89,54.45 | v54.5,63.41 54.5,63.34 | 57.04,62.71 54.52,62.71 | v50.97,62.66 52.01,62.66 52.49,62.17 53.26,62.17 53.79,62.71 54.52,62.71 | v54.5,63.41 54.5,62.73 54.52,62.71 | v57.01,61 57.01,62.68 57.04,62.71
  Top 1.27: 23.65,49.59 24.15,49.09 24.15,40.71 32.05,32.81 35.86,32.81 | 33.98,36.98 35.86,36.98 35.86,32.81 | 78.8,25.44 78.8,16.81 73.96,16.81 70.26,20.5 48.86,20.5 48.86,20.51 | 78.8,42.46 78.8,43.16 78.72,43.24 78.72,45.95 | 48.86,20.51 48.86,30.8 46.83,32.83 38.04,32.83 38.02,32.81 35.86,32.81 | 45.01,10.13 45.01,11.48 46.52,13 46.52,18.18 48.86,20.51 | 78.81,25.45 78.8,25.44 | v80.46,42.45 78.81,42.45 78.8,42.46 | NEO_PIX2.1 71.54,40.17 v73.7,40.17 | 78.8,25.44 78.8,37.62 78.88,37.7 78.88,38.79 78.8,38.87 v78.8,40.1 79.42,40.72 79.42,41.66 78.8,42.28 78.8,42.46
  Bottom 0.305: 58.2,50.43 57.95,50.43 57.13,50.43 57.13,50.48 | 57.13,50.48 C34.1 | U$5.13 56.34,55.79 56.34,55.01 v56.63,54.72 57.13,54.22 57.13,50.48 | 58.23,60.47 C28.1 57.12,60.9 v57.01,61 57.06,60.95 57.06,56.43 56.43,56.43 | U$5.9 54.39,61.41 54.39,62.96 54.4,62.95 54.4,63.31 v54.5,63.41 | 54.38,55 U$5.16 54.38,54.49 54.56,54.31 v54.56,54.23 | U$5.21 51.1,55.77 51.1,54.91 51.07,54.88 51.07,54.63 v50.89,54.45 | U$5.4 51.14,61.41 51.14,62.2 50.97,62.37 v50.97,62.66
  Bottom 0.635: 56.43,56.38 56.43,54.96 57.04,54.34 57.04,51.12 C34.1 | C33.1 58.2,60.44 58.23,60.47
  Bottom 0.762: NEO_PIX2.1 66.34,45.38 66.34,48.81 64.81,50.33 58.05,50.33 57.95,50.43
  Bottom 1.27: 80.48,44.05 80.48,42.47 v80.46,42.45 | v73.7,40.17 76.72,40.17 77.04,39.85 78.7,39.85 78.71,39.84 78.8,39.94 v78.8,40.1
_BUT1  (1 unrouted)
_BUT2  (1 unrouted)
AGND  (via drill 0.35, 0.65, 1)  (21 unrouted)
  Top 0.305: C29.1 R5.1 56.07,66.95 57.06,65.95 57.06,64.8 v57.08,64.79 | U$5.EXP@16 57.31,59.9 57.47,60.06 v69.53,60.06
  Top 0.635: v32.05,67.1 33.06,68.11 52.25,68.11 C29.1
  Top 0.762: v51.4,29.91 51.4,31.21 45.51,37.1 45.51,37.23
  Bottom 0.305: v57.08,64.79 57.05,64.75 57.05,62.11 U$5.12 56.32,61.39 56.32,60.58 56.01,60.27 U$5.EXP@16 | U$8.AGND 69.84,58.85 69.53,59.16 v69.53,60.06 | U$5.1 49.18,60.23 U$5.EXP@1 | U$5.24 49.18,57.82 49.97,58.6 U$5.EXP@8
  Bottom 0.635: v32.05,67.1 24.43,59.48 24.43,59.07 | 24.4,39.21 24.4,38.24 23.38,37.23 | 24.78,35.7 24.78,38.83 24.78,58.72 24.43,59.07 | 24.38,59.12 24.43,59.07
  Bottom 0.762: 24.4,39.21 24.78,38.83 | 24.78,35.7 34.96,25.53 48.13,25.53 51.4,28.8 v51.4,29.91
AUDIO_LEFT+
  Bottom 0.508: U$5.5 51.78,63.1 49.26,65.62 40.74,65.62 39.67,64.55 39.67,61.31 | 39.67,61.31 39.67,60.73 39.59,60.73 | J1.1 26.27,48.44 38.57,60.73 39.59,60.73 | J3.1 61.61,42.73 51.9,42.73 51.9,42.71 | 51.9,42.71 49.53,42.71 49.48,42.71 | 49.48,42.71 48.91,42.71 46.5,45.13 40.43,45.13 39.59,45.97 39.59,60.73 | 49.48,42.71 J5.1 | J2.1 39.68,61.29 39.67,61.31 | 51.9,42.71 51.9,32.33 47.62,28.05 47.62,27.77 J4.1
AUDIO_LEFT-  (via drill 0.65, 0.7)  (2 unrouted)
  Top 0.508: v29.1,52.8 J6.1 | v37.38,61.76 38.6,60.55 v38.6,59.35 | v40.68,62.73 37.94,62.73 v37.38,63.29 | J11.1 46.78,42.71 49.41,40.08 49.41,39.59 | 49.41,36.1 49.41,39.59 51.44,41.63 v54.91,41.63
  Bottom 0.508: U$5.8 53.69,61.45 53.69,63.48 50.84,66.34 40.43,66.34 v37.38,63.29 v37.38,61.76 37.38,60.63 29.55,52.8 v29.1,52.8 | v38.6,59.35 38.73,59.35 38.88,59.2 38.88,45.67 40.18,44.37 46.25,44.37 47.12,43.5 47.12,43.18 J11.1 | v49.37,36.06 49.37,32.35 J10.1 | v54.91,41.63 60.74,41.63 61.15,41.22 63.16,41.22 J9.1 | J8.1 40.68,63.11 v40.68,62.73
AUDIO_RIGHT+  (via drill 0.6, 0.75)
  Top 0.508: v40.71,46.42 37.48,43.2 37.48,42.37 37.64,42.21 | 37.64,42.21 39.84,40.02 J5.3 | 37.64,42.21 37.64,42.14 37.57,42.14 v36.46,41.03
  Bottom 0.508: J4.3 41.85,27.79 40.43,29.21 40.43,30.72 41.11,31.41 41.11,37.1 37.99,40.23 37.97,40.23 37.16,41.03 v36.46,41.03 35.62,41.88 30.36,41.88 29.68,41.19 27.67,41.19 J1.3 | J2.3 45.41,59.9 42.13,59.9 40.46,58.22 40.46,53.27 40.48,53.25 40.48,46.65 | 40.48,46.65 41.27,45.86 46.88,45.86 46.88,45.82 47.5,45.21 48.4,45.21 49.06,45.86 | 40.48,46.65 40.48,46.42 v40.71,46.42 | J3.3 61.42,47.69 60.87,47.14 51.92,47.14 50.64,45.86 49.06,45.86 | 49.06,45.86 49.27,46.08 49.27,47.35 51.9,49.98 51.9,53.08 51.71,53.27 51.71,54.04 51.78,54.11 U$5.20
AUDIO_RIGHT-  (via drill 0.7)
  Top 0.508: v50.28,46.93 v46.24,46.93 46.26,46.94 46.26,48.68 45.58,49.36 42.14,49.36 41.82,49.05 41.82,46.03 38.55,42.77 v38.47,42.77
  Bottom 0.508: J6.3 36.62,42.59 | 36.62,42.59 38.29,42.59 v38.47,42.77 38.53,42.71 41.57,42.71 J11.3 | J8.3 46.8,63.27 48.2,61.87 48.2,60.72 46.67,59.19 42.42,59.19 41.17,57.93 41.17,53.56 41.19,53.54 41.19,47.73 42.35,46.58 45.89,46.58 v46.24,46.93 | v50.28,46.93 52.01,48.66 | J9.3 63.7,47.69 62.3,49.09 61.15,49.09 59.91,47.85 52.82,47.85 52.01,48.66 | U$5.17 53.73,54.58 53.73,54.57 53.73,53.79 54.44,53.08 54.44,51.09 52.01,48.66 | 36.62,42.59 38.27,40.94 38.28,40.94 41.83,37.39 J10.3
BCLK  (via drill 0.35)  (2 unrouted)
  Top 0.203: 69.56,53.66 74.69,53.66 75.45,54.42 v76.04,54.42 | v73.19,45.54 72.36,46.38 72.36,47.46 70.55,49.27 v68.37,49.27
  Bottom 0.203: v76.04,54.42 76.04,55.2 U$8.I2S_SCLK | MEMS1.4 74.24,45.54 v73.19,45.54 | v68.37,49.27 68.37,52.47
BUT1  (1 unrouted)
BUT2  (1 unrouted)
BUT3  (1 unrouted)
BUT4  (1 unrouted)
BUT5  (1 unrouted)
BUT6  (1 unrouted)
BUT7  (1 unrouted)
BUT8  (1 unrouted)
BYPASS
  Bottom 0.203: U$5.22 50.48,55.05 49.69,54.26 48.86,54.26 48.23,53.63 47.73,53.63 47.12,53.02 47.12,51.35 47.89,50.59 C32.1
COSC  (via drill 0.35)  (1 unrouted)
  Top 0.203: v55.41,63.39 55.41,63.44 53.81,65.05
  Bottom 0.203: v55.41,63.39 55.03,63.01 U$5.10
DIN  (1 unrouted)
DOUT  (via drill 0.35)  (2 unrouted)
  Top 0.203: v77.33,49.12 77.33,48.58 77.08,48.33 77.08,47.77 77.26,47.59 77.26,42.54 75.3,40.58 | DOUT.1 75.35,38.1
  Bottom 0.203: v77.33,49.12 77.05,49.12 75.8,50.32 R2.2
EDITROUTE  (via drill 0.35)
  Top 0.203: v69.33,55.13 73.12,55.13 v76.62,58.64
  Bottom 0.203: U$8.VDDIO 77.66,57.85 C48.1 76.87,58.64 v76.62,58.64 77.74,59.76 FERRITE1.2 | U$8.VDDD 72.14,54.21 72.13,54.2 70.26,54.2 69.33,55.12 v69.33,55.13 68.4,55.13 C49.1
  Bottom 0.305: C48.1 77.91,59.68 FERRITE1.2
GND  (via drill 0.35)  (193 unrouted)
  Top 0.203: U2.5 73.96,48.56 | 73.96,48.56 75.8,48.56 C9.2 | U2.4 73.96,48.56 | VMEL1.1 70.94,30.61 VEML1.3 70.68,32.15 70.68,33.06 70.28,33.06 | 70.91,28.24 71.32,28.65 71.32,30.04
  Top 0.305: v49.05,51.46 49.02,51.49 47.72,51.49
  Bottom 0.203: U$5.18 U$5.19 | U$5.6 U$5.7 | U$8.GND3 71.67,56.85 | 71.67,56.85 72.43,56.85 72.85,56.85 | 71.64,56.43 71.64,56.82 71.67,56.85
  Bottom 0.305: C50.2 69.18,56.85 U$8.GND3 72.43,56.85 | 71.64,56.43 U$8.CTRL_ADR0_CS U$8.CTRL_MODE U$8.GND2 | 48.78,49.46 48.79,49.46 49.06,49.74 49.06,51.45 v49.05,51.46
  other vias: 68.37,82.85 69.38,82.85 70.4,82.85 68.88,82.08 69.89,82.08 83.46,81.27 82.97,82.01 85.89,82.85 83.86,82.08 65.27,62.93 66.29,62.93 67.3,62.93 68.32,62.93 69.33,62.93 65.57,61.51 66.59,61.51 67.61,61.51 68.62,61.51 83.86,11.73 83.86,10.71 83.05,11.17 88.18,11.73 88.18,10.71 88.87,11.19 86.66,82.85 86.35,81.96 79.8,87.16 79.16,86.58 78.71,87.44 12.64,84.78 14.27,85.64 14.77,84.88 13.25,84.12 13.91,83.43 16.04,79.04 17.06,79.04 18.08,79.04 16.55,78.27 17.57,78.27 52.77,62.86 51.98,64.05 51.22,64.79 48.61,62.81 48.58,63.67 48.53,64.53 46.32,67.22 47.34,67.22 48.35,67.22 46.32,69.26 47.34,69.26 48.35,69.26 32.6,69.26 33.62,69.26 34.64,69.26 32.6,65.45 33.62,65.45 34.64,65.45 61.46,64.96 62.48,64.96 63.49,64.96 64.51,64.96 65.52,64.96 67.68,29.81 68.7,29.81 68.7,28.79 52.9,54.4 59,55.16 60.01,55.16 61.03,55.16 27.52,53 26.51,53 27.04,51.76 40.22,35.73 39.46,35.73 53.66,48.81 54.68,48.81 55.69,48.81 29.3,39.28 28.29,39.28 28.79,38.27 50.05,19.17 51.32,19.17 52.59,19.17 52.59,18.15 51.32,18.15 50.05,18.15 59.71,19.17 60.98,19.17 60.98,18.15 59.71,18.15 15.46,84.24 69.38,56.61 64.81,54.91 48.48,56.07 80.05,47.51 80.94,47.51 80.94,48.53 80.05,48.51
  pour Top: -0.01,90.21 -0.01,0.09 90.31,0.09 90.31,90.21
  pour Top: 0.04,90.21 89.96,90.21 89.96,0.04 0.04,0.04
  pour Bottom: 0.04,90.21 89.96,90.21 89.96,0.04 0.04,0.04
LOUT_L  (via drill 0.35)
  Top 0.203: v49.39,63.39 49.85,63.85 C53.2
  Bottom 0.203: U$5.2 49.83,62.52 49.39,62.96 v49.39,63.39
LOUT_R
  Bottom 0.203: U$5.23 49.83,55.04 49.46,54.67 48.7,54.67 48.06,54.03 47.57,54.03 46.67,53.13 46.67,52.15 45.75,51.23 C54.2
LRCLK  (via drill 0.35)  (1 unrouted)
  Top 0.203: v76.39,55.81 76.25,55.81 74.5,54.07 63.41,54.07 62.36,53.02 62.36,52.61 61.13,51.38 60.2,51.38 58.04,49.22 58.04,48.9 56.43,47.29 56.43,41.97 55.29,40.83 52.44,40.83 50.71,39.1
  Bottom 0.203: U$8.I2S_LRCLK 75.86,56.35 76.09,56.12 76.09,56.11 v76.39,55.81 76.95,55.25 76.95,54.51 77.15,54.32 77.15,52.15 76.93,51.93 76.93,51.09 77.48,50.54 77.63,50.54 78.17,49.99 78.17,49.82 78.42,49.57 78.42,48.36 78.45,48.33 78.45,47.77 78.17,47.49 78.17,47.09 77.68,46.6 MEMS1.1
MCLK  (via drill 0.35)  (1 unrouted)
  Top 0.203: 74.23,53.26 74.86,53.26 75.34,53.74 79.04,53.74 v79.04,53.76
  Bottom 0.203: v79.04,53.76 79.81,54.53 R9.1
MISO  (via drill 0.35)  (1 unrouted)
  Top 0.203: 75.04,52.59 73.59,51.14 63.23,51.14 63.22,51.12 62.6,51.12 61.63,50.16 60.7,50.16 59.26,48.71 59.26,48.39 57.7,46.83 57.7,39.45 59.37,37.78 59.37,36.69 58.64,35.95 v58.64,32.79 | v57.12,17.14 53.64,17.14 51.86,15.36 J7.7
  Bottom 0.203: v58.64,32.79 58.64,28.7 58.71,28.62 58.71,18.23 57.62,17.14 v57.12,17.14
MOSI  (via drill 0.35)  (1 unrouted)
  Top 0.203: v56.3,15.41 56.3,13.5 J7.3 | v56.43,32.79 56.84,32.79 56.84,47.12 58.45,48.73 58.45,49.05 60.37,50.97 61.3,50.97 62.26,51.93 62.75,51.93
  Bottom 0.203: v56.43,32.79 56.43,15.54 v56.3,15.41
N$1
  Bottom 0.203: MEMS1.6 75.38,48.3 R2.1
N$2
  Bottom 0.508: MIC1.1 32.74,46 29.68,49.06 28.52,49.06 27.7,48.25 27.7,46.57 J1.2
N$3  (via drill 0.7)
  Top 0.508: J2.2 45.2,60.35 v45.2,58.18
  Bottom 0.508: v45.2,58.18 45.2,55.25 MIC2.1
N$4
  Top 0.203: VMEL1.6 72.21,30.7 72.21,31.47 | 72.21,31.47 VEML1.2 72.08,32.03 72.08,33.51 C8.1 69.43,34.02 C10.1 | R1.1 71.91,28.23 71.91,31.17 72.21,31.47 | 72.21,31.47
N$6
  Bottom 0.508: MIC3.1 60.57,44 J3.2
N$7  (via drill 0.7)
  Top 0.508: J4.2 42.98,28.49 41.12,28.49 40.43,29.18 40.43,30.52 v39.62,31.34 | v39.8,34.2 40.19,34.59 MIC4.1
  Bottom 0.508: v39.62,31.34 39.62,34 39.8,34.19 v39.8,34.2
N$8
  Top 0.508: J5.2 42.82,41.44 41.12,41.44 40.3,42.26 40.3,43.42 43.01,46.13 MIC5.1
N$9  (1 unrouted)
N$10  (1 unrouted)
N$25
  Bottom 0.508: J6.2 30.23,44 MIC1.2
N$27  (via drill 0.35)
  Top 0.203: v52.14,66.16 50.19,66.16 C53.1 | v58.46,62.25 58.51,62.2 70.61,62.2 70.76,62.05 v71.12,62.05
  Bottom 0.203: U$8.LINEOUT_R 72.14,61.03 v71.12,62.05 | v52.14,66.16 56.89,66.16 57.72,65.32 57.72,62.37 57.84,62.25 v58.46,62.25
N$28  (1 unrouted)
N$32
  Top 0.508: MIC2.2 45.19,57.16 45.62,57.16 48.2,59.74 48.2,61.87 47.38,62.69 45.72,62.69 J8.2
N$34
  Bottom 0.203: U$8.VAG 71.64,60.88 71.16,61.36 69.74,61.36 68.44,60.06 C57.1
N$35  (via drill 0.35)
  Top 0.203: DIN.2 55.72,40.2 55.77,40.15 v55.75,40.15 | v73.91,50.58 73.91,50.73 63.43,50.73 63.41,50.71 62.76,50.71 61.8,49.75 60.87,49.75 59.67,48.54 59.67,48.14 58.11,46.57 58.11,40.85 58.76,40.2 v58.79,40.2
  Bottom 0.203: v55.75,40.15 58.56,40.15 58.64,40.07 58.66,40.07 v58.79,40.2 | U$8.I2S_DIN 74.14,53.48 74.61,53.02 74.61,52.1 73.91,51.4 v73.91,50.58
N$36  (via drill 0.35)
  Top 0.203: DOUT.2 76.37,41.05 77.77,42.45 v77.77,48.05
  Bottom 0.203: U$8.I2S_DOUT 74.64,53.56 75.05,53.15 75.05,52.06 75.69,51.42 76.05,51.42 76.38,51.09 76.38,51.02 77.31,50.08 77.51,50.08 77.77,49.83 77.77,49.65 78.02,49.4 78.02,48.83 77.77,48.58 v77.77,48.05
N$38
  Bottom 0.203: U$8.SYS_MCLK 76.09,57.35 77.91,55.53 R9.2
N$39
  Bottom 0.305: U$9.2 65.77,56.99 C50.1 67.35,58.57 67.56,58.78 69.15,58.78 69.63,58.3 69.63,58.06 69.84,57.85 U$8.VDDA
N$40  (via drill 0.7)
  Top 0.508: J9.2 63.12,43.72 63.12,42.03 62.3,41.22 61.15,41.22 60.33,42.03 60.33,46 v60.25,46.08
  Bottom 0.508: v60.25,46.08 55.24,46.08 MIC3.2
N$41  (1 unrouted)
N$42
  Bottom 0.508: J10.2 45.24,30.76 MIC4.2
N$44
  Top 0.508: J11.2 44.26,42.84 45.01,43.6 MIC5.2
N$45  (1 unrouted)
N$46  (1 unrouted)
N$47  (1 unrouted)
N$48  (1 unrouted)
N$49  (1 unrouted)
N$50  (1 unrouted)
N$51  (1 unrouted)
N$52  (1 unrouted)
N$53  (1 unrouted)
N$54  (1 unrouted)
N$55  (1 unrouted)
N$56  (1 unrouted)
N$57  (1 unrouted)
N$58  (1 unrouted)
N$59  (1 unrouted)
N$60  (1 unrouted)
N$61  (1 unrouted)
N$62  (1 unrouted)
N$63  (1 unrouted)
N$64  (1 unrouted)
N$65  (1 unrouted)
NEO_PIX1  (1 unrouted)
NEO_PIX1_OUT  (1 unrouted)
NEO_PIX2  (1 unrouted)
  Bottom 0.203: NEO_PIX2.2 67.62,45.18 67.02,45.78 67.02,49.09 65.95,50.17
POT1  (1 unrouted)
ROSC  (via drill 0.35)
  Top 0.203: v56.33,63.39 56.33,64.43 R5.2
  Bottom 0.203: U$5.11 55.67,61.42 55.67,62.73 v56.33,63.39
SCL  (via drill 0.35, 0.51)  (2 unrouted)
  Top 0.203: VMEL1.5 72.76,29.77 73.48,30.48 VEML1.1 75.02,33.44 v75.28,33.44 | R4.1 60.88,37.37 60.87,37.38 60.87,39.14 58.51,41.5 58.51,46.41 60.08,47.97 60.08,48.38 61.04,49.34 61.97,49.34 62.93,50.31 63.6,50.31 63.62,50.33 71.44,50.33 v71.74,50.02 72.28,49.48 U2.2
  Bottom 0.203: U$8.CTRL_CLK 72.64,54.03 72.07,53.46 72.07,50.35 v71.74,50.02 | v75.28,33.44 74.9,33.06 68.06,33.06 67.3,33.82 67.3,34.08 65.9,35.48 61.72,35.48 60.87,36.33
SD_CS  (via drill 0.35)  (1 unrouted)
  Top 0.203: v57.67,32.17 57.67,32.26 57.27,32.66 57.27,46.98 58.86,48.56 58.86,48.88 60.54,50.56 61.47,50.56 62.43,51.52 63.05,51.52 63.07,51.54 68.92,51.54 69.96,52.59 | v58.03,28.34 61.68,28.34 R11.1 | J7.2 57.36,15.4 57.8,15.84 57.8,18.66 v57.81,18.65
  Bottom 0.203: v57.67,32.17 57.95,31.89 57.95,29.12 58.03,29.05 v58.03,28.34 57.81,28.12 v57.81,18.65
SDA  (via drill 0.35)  (1 unrouted)
  Top 0.203: VMEL1.2 70.35,29.77 69.67,30.45 VEML1.4 69.67,31.24 69.69,31.21 67.5,31.21 66.06,32.66 65.01,32.66 63.7,33.96 R3.1 63.47,37.2 63.32,37.34 58.97,41.7 58.97,45.97 60.48,47.48 60.48,48.21 61.21,48.94 62.14,48.94 63.1,49.9 70.56,49.9 71.47,48.99 v71.75,48.99 71.75,48.69 72.53,47.9 72.69,47.9 U2.3
  Bottom 0.203: U$8.CTRL_DATA 73.59,55.05 73.59,54.39 72.47,53.28 72.47,49.72 v71.75,48.99
SPI_CLK  (via drill 0.35, 0.51)  (1 unrouted)
  Top 0.203: v65.02,33.82 65.02,34.38 66.75,36.11 72.33,36.11 | v57.12,16.12 57.04,16.2 54.65,16.2 54.06,15.61 J7.5
  Bottom 0.203: v57.12,16.12 57.22,16.02 62.5,16.02 64.05,17.57 64.05,32.2 65.02,33.16 v65.02,33.82
TPA_SHDN  (via drill 0.35)  (1 unrouted)
  Top 0.203: 52.18,52.59 51.14,53.63 49.96,53.63 47.67,55.92 47.67,57.2 48.04,57.57 48.77,58.3 48.77,61.7 50.19,63.11 v50.21,63.11
  Bottom 0.203: U$5.3 50.48,62.24 50.33,62.39 50.33,62.98 v50.21,63.11
VEML_INT  (via drill 0.35)  (1 unrouted)
  Top 0.203: v49.94,49.2 51.14,48 51.14,42.51 v50.33,41.7 | VMEL1.3 70.42,29.12 69.07,30.46 53.4,30.46 50.33,33.52 v50.33,33.57
  Bottom 0.203: 50.71,49.96 v49.94,49.2 | v50.33,41.7 50.33,38.45 49.66,37.78 49.66,36.91 50.33,36.24 v50.33,33.57
VIN  (2 unrouted)
VOL  (via drill 0.35)  (1 unrouted)
  Top 0.305: v55.69,54.04 55.41,54.04 54.34,52.97 54.34,52.13 53.7,51.49 50.25,51.49 49.61,52.13 49.61,53.32 48.8,54.13 42.72,54.13 40.28,56.58
  Bottom 0.305: v55.69,54.04 55.68,54.05 U$5.14

### Text on the board
tPlace: Legatus | v0.1, 2020 | NVS | L | R | VOLUME | OFF | L | R | R | L | ON | R | L | RATE | R | L | ON | OFF | 1 | 2 | 3 | 4 | 5 | 6 | 7 | 8 | movee | movee | movee
bValues: + | - | + | -